# Altium project BMS_Master.PrjPcb (part 1 of 2)
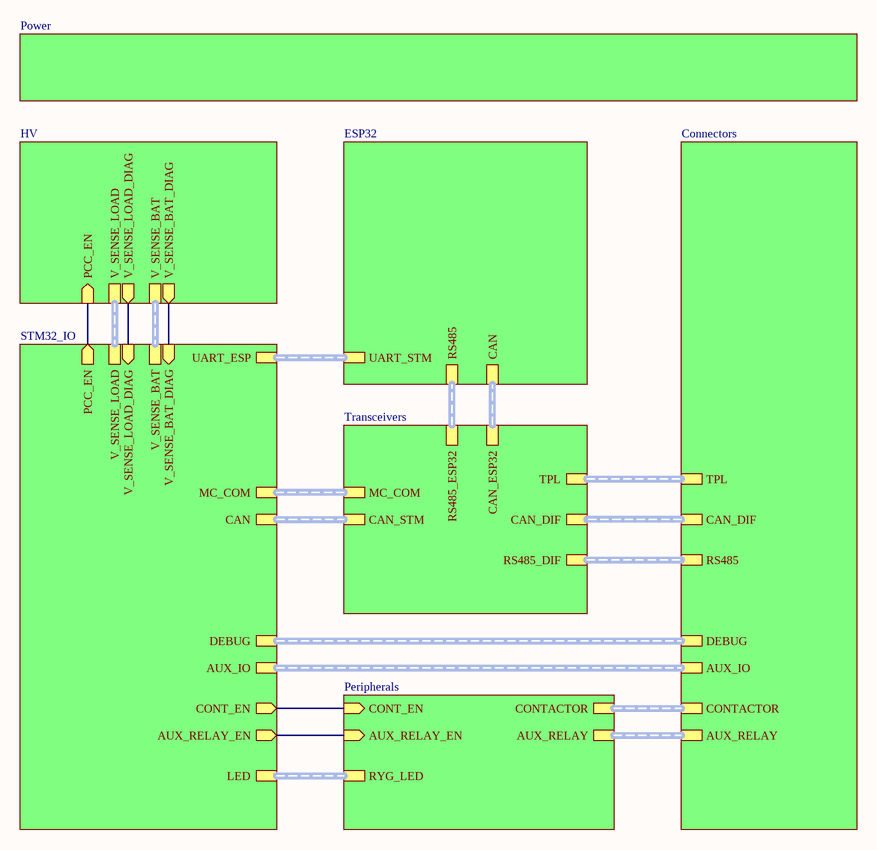
[diagram p0: Top.SchDoc]
Author: Bram Bremer; ProjectPrettyName: BMS Master
10 sheets, 231 parts. Net scope: hierarchical (ports join the sheet entries above them; power ports are global).
Board file: Master.PcbDoc
Sheets:
  Top.SchDoc
    STM32 = STM32_IO.SchDoc
    Power = Power.SchDoc
    Transceivers = Transceivers.SchDoc
    Peripherals = Peripherals.SchDoc
      ContactorDriver = RelayDriver.SchDoc
      AuxRelay = RelayDriver.SchDoc
    Connectors = Connectors.SchDoc
    Designator = HV.SchDoc
      LOADsense = HVsense.SchDoc
      BATsense = HVsense.SchDoc
    ESP32 = ESP32.SchDoc

## Sheet Top.SchDoc: Top level
size A4; Author: Bram Bremer; CompanyName: Green Team Twente; Organization: Green Team Twente; Revision: V1.1; SheetNumber: 1; SheetTotal: 10; Team: 2024; Subsystem: Embedded Systems

### Sub-sheets
Connectors = Connectors: CAN_DIF (harness CAN_DIF), TPL (harness TPL), CONTACTOR (harness CONTACTOR), DEBUG (harness STDC14), RS485 (harness RS485_DIF), AUX_RELAY (harness AUX_RELAY), AUX_IO (harness AUX_IO)
Designator = HV: PCC_EN (in), V_SENSE_LOAD, V_SENSE_BAT, V_SENSE_LOAD_DIAG (out), V_SENSE_BAT_DIAG (out)
ESP32 = ESP32: RS485 (harness RS485), CAN (harness CAN), UART_STM (harness UART)
Peripherals = Peripherals: CONT_EN (in), RYG_LED (harness RGB_LED), CONTACTOR (harness CONTACTOR), AUX_RELAY_EN (in), AUX_RELAY (harness AUX_RELAY)
Power = Power: no entries
STM32 = STM32_IO: DEBUG (harness STDC14), MC_COM (harness MC_COM), CAN (harness CAN), LED (harness RYG_LED), AUX_RELAY_EN (out), CONT_EN (out), V_SENSE_LOAD (harness ANA_DIF), V_SENSE_BAT (harness ANA_DIF), PCC_EN (out), V_SENSE_LOAD_DIAG (in), V_SENSE_BAT_DIAG (in), AUX_IO (harness AUX_IO), UART_ESP (harness UART)
Transceivers = Transceivers: CAN_STM (harness CAN), MC_COM (harness MC_COM), CAN_DIF (harness CAN_DIF), TPL (harness TPL), CAN_ESP32 (harness CAN), RS485_DIF (harness RS485_DIF), RS485_ESP32 (harness RS485)

### Nets
AUX_RELAY_EN: sheet STM32/AUX_RELAY_EN, sheet Peripherals/AUX_RELAY_EN
CONT_EN: sheet STM32/CONT_EN, sheet Peripherals/CONT_EN
PCC_EN: sheet STM32/PCC_EN, sheet Designator/PCC_EN
V_SENSE_BAT_DIAG: sheet STM32/V_SENSE_BAT_DIAG, sheet Designator/V_SENSE_BAT_DIAG
V_SENSE_LOAD_DIAG: sheet STM32/V_SENSE_LOAD_DIAG, sheet Designator/V_SENSE_LOAD_DIAG

### Buses and harness runs
harness sheet Connectors/AUX_IO = sheet STM32/AUX_IO
harness sheet Connectors/AUX_RELAY = sheet Peripherals/AUX_RELAY
harness sheet Connectors/CAN_DIF = sheet Transceivers/CAN_DIF
harness sheet Connectors/CONTACTOR = sheet Peripherals/CONTACTOR
harness sheet Connectors/DEBUG = sheet STM32/DEBUG
harness sheet Connectors/RS485 = sheet Transceivers/RS485_DIF
harness sheet Connectors/TPL = sheet Transceivers/TPL
harness sheet Designator/V_SENSE_BAT = sheet STM32/V_SENSE_BAT
harness sheet Designator/V_SENSE_LOAD = sheet STM32/V_SENSE_LOAD
harness sheet ESP32/CAN = sheet Transceivers/CAN_ESP32
harness sheet ESP32/RS485 = sheet Transceivers/RS485_ESP32
harness sheet ESP32/UART_STM = sheet STM32/UART_ESP
harness sheet Peripherals/RYG_LED = sheet STM32/LED
harness sheet STM32/CAN = sheet Transceivers/CAN_STM
harness sheet STM32/MC_COM = sheet Transceivers/MC_COM

### Notes on the sheet
- Team
- Authors
- Revision
- Title
- Project
- Subsystem
- File
- Sheet
- //

## Sheet STM32_IO.SchDoc: STM32 IO
size A3; CompanyName: Green Team Twente; Organization: Green Team Twente; Revision: V1.1; SheetNumber: 4; SheetTotal: 10; Team: 2024; Subsystem: Embedded Systems
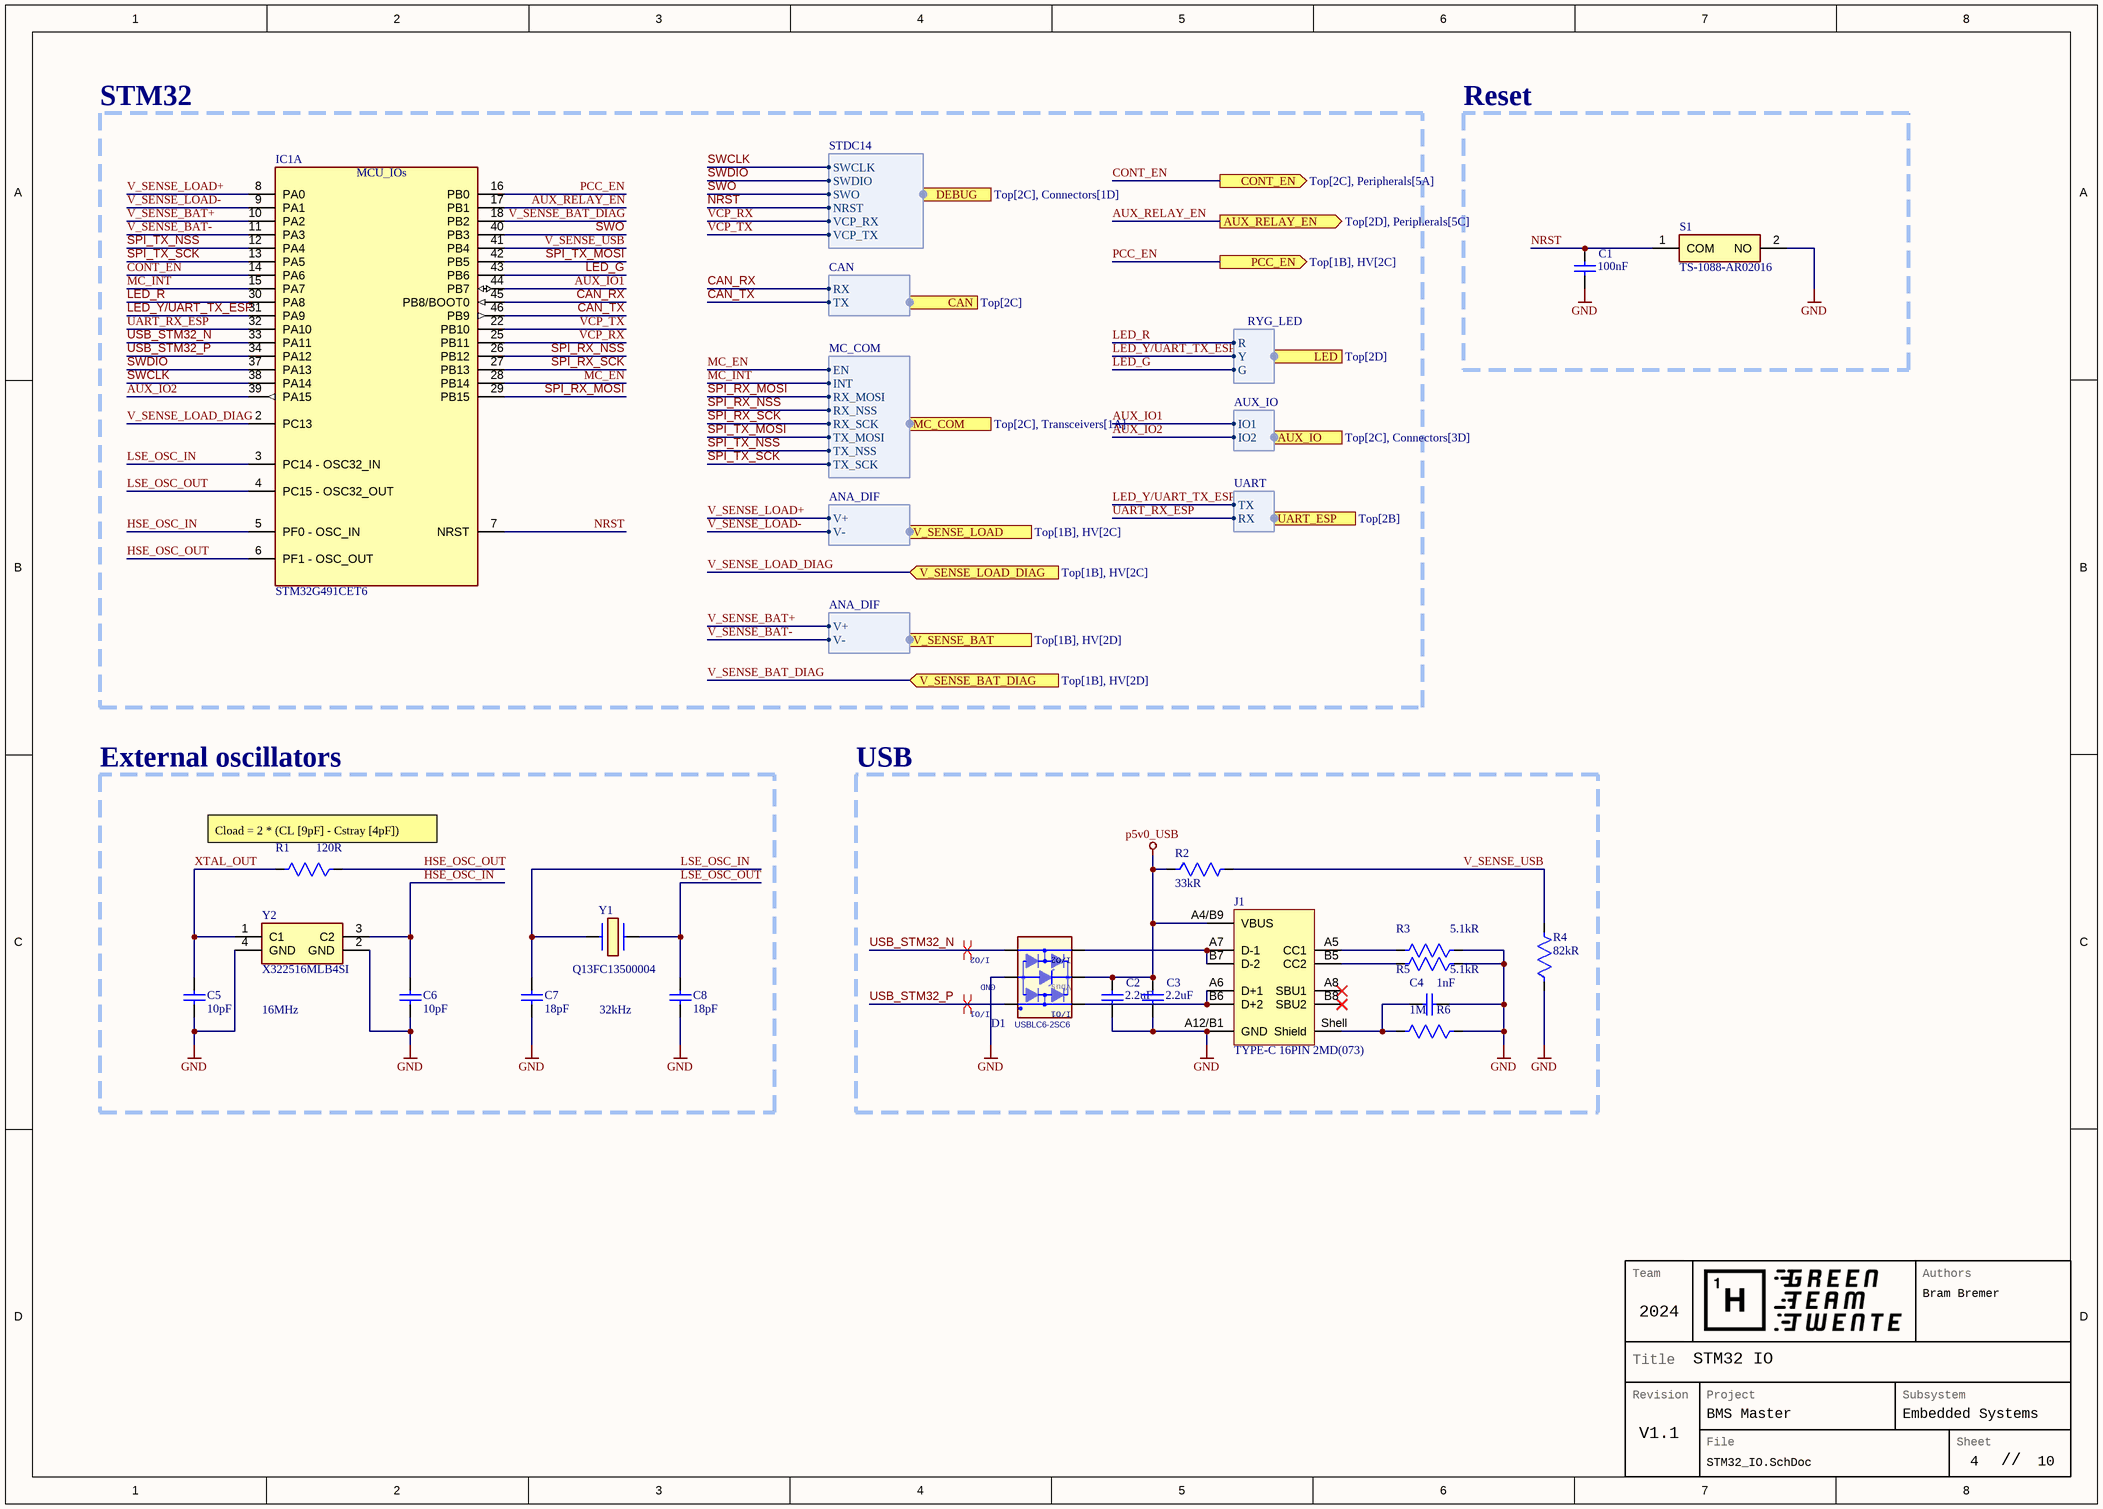
[diagram p1: STM32_IO.SchDoc]

### Parts
C1  value 100nF  [WCAP-CSGP_0402_L1W0.5H0.5]  (hidden comment: CAP 0402 100nF X7R)
C2  value 2.2uF  [WCAP-CSGP_0603_L1.6W0.8H0.8_Reflow]  (hidden comment: CAP 0603 2.2uF X7R)
C3  value 2.2uF  [WCAP-CSGP_0603_L1.6W0.8H0.8_Reflow]  (hidden comment: CAP 0603 2.2uF X7R)
C4  value 1nF  [WCAP-CSGP_1206_L3.2W1.6H1.15]  (hidden comment: CAP 1206 1nF X7R)
C5  value 10pF  [WCAP-CSGP_0402_L1W0.5H0.5]  (hidden comment: CAP 0402 10pF X7R)
C6  value 10pF  [WCAP-CSGP_0402_L1W0.5H0.5]  (hidden comment: CAP 0402 10pF X7R)
C7  value 18pF  [WCAP-CSGP_0402_L1W0.5H0.5]  (hidden comment: CAP 0402 18pF X7R)
C8  value 18pF  [WCAP-CSGP_0402_L1W0.5H0.5]  (hidden comment: CAP 0402 18pF X7R)
D1  USBLC6-2SC6  [ST_SOT23-6L]
IC1  STM32G491CET6  [QFP50P900X900X160-48N]  (part A of 2)
J1  TYPE-C 16PIN 2MD(073)  [629722000214]
R1  value 120R  [FP0402]  (hidden comment: RES 0402 120R 1%)
R2  value 33kR  [FP0402]  (hidden comment: RES 0402 33kR 1%)
R3  value 5.1kR  [FP0402]  (hidden comment: RES 0402 5.1kR 1%)
R4  value 82kR  [RES_SM0603_YAGEORC_N]  (hidden comment: RES 0603 82kR 1%)
R5  value 5.1kR  [FP0402]  (hidden comment: RES 0402 5.1kR 1%)
R6  value 1M  [RES_SM1206_YAGEORC_N]  (hidden comment: RES 1206 1M 1%)
S1  TS-1088-AR02016  [TS1088AR02016]
Y1  Q13FC13500004  [Q13FC1350000400]
Y2  X322516MLB4SI  [X322516MLB4SI]

### Blocks framed on the sheet
STM32: IC1
Reset: C1 S1
External oscillators: C5-C8 R1 Y1 Y2
USB: C2-C4 D1 J1 R2-R6

### Ports
AUX_IO (out, harness AUX_IO, see Top[2C], Connectors[3D]), AUX_RELAY_EN (out, see Top[2D], Peripherals[5C]), CAN (harness CAN, see Top[2C]), CONT_EN (out, see Top[2C], Peripherals[5A]), DEBUG (harness STDC14, see Top[2C], Connectors[1D]), LED (harness RYG_LED, see Top[2D]), MC_COM (out, harness MC_COM, see Top[2C], Transceivers[1A]), PCC_EN (out, see Top[1B], HV[2C]), UART_ESP (out, harness UART, see Top[2B]), V_SENSE_BAT (out, harness ANA_DIF, see Top[1B], HV[2D]), V_SENSE_BAT_DIAG (in, see Top[1B], HV[2D]), V_SENSE_LOAD (out, harness ANA_DIF, see Top[1B], HV[2C]), V_SENSE_LOAD_DIAG (in, see Top[1B], HV[2C])

### Harnesses
MC_COM: EN, INT, RX_MOSI, RX_NSS, RX_SCK, TX_MOSI, TX_NSS, TX_SCK
CAN: RX, TX
RYG_LED: G, R, Y
ANA_DIF: V+, V-
AUX_IO: IO1, IO2
STDC14: SWDIO, SWCLK, NRST, SWO, VCP_RX, VCP_TX
UART: TX, RX

### Nets
GND: C1.1 C2.1 C3.1 C4.2 C5.1 C6.1 C7.1 C8.1 D1.2(GND) J1.A12/B1(GND) R3.1 R4.1 R5.1 R6.1 S1.2(NO) Y2.2(GND) Y2.4(GND)
p5v0_USB: C2.2 C3.2 D1.5(Vbus) J1.A4/B9(VBUS) R2.1
AUX_IO1: IC1.44(PB7) ; port AUX_IO.IO1
AUX_IO2: IC1.39(PA15) ; port AUX_IO.IO2
AUX_RELAY_EN: IC1.17(PB1) ; port AUX_RELAY_EN
CAN_RX: IC1.45(PB8/BOOT0) ; port CAN.RX
CAN_TX: IC1.46(PB9) ; port CAN.TX  [project net CAN_STM_TX]
CONT_EN: IC1.14(PA6) ; port CONT_EN
HSE_OSC_IN: C6.2 IC1.5(PF0_-_OSC_IN) Y2.3(C2)
HSE_OSC_OUT: IC1.6(PF1_-_OSC_OUT) R1.1
LED_G: IC1.43(PB6) ; port LED.G
LED_R: IC1.30(PA8) ; port LED.R
LED_Y/UART_TX_ESP: IC1.31(PA9) ; port LED.Y, port UART_ESP.TX  [project net LED_Y]
LSE_OSC_IN: C7.2 IC1.3(PC14_-_OSC32_IN) Y1.2(CRYSTAL_2)
LSE_OSC_OUT: C8.2 IC1.4(PC15_-_OSC32_OUT) Y1.1(CRYSTAL_1)
MC_EN: IC1.28(PB14) ; port MC_COM.EN
MC_INT: IC1.15(PA7) ; port MC_COM.INT
NRST: C1.2 IC1.7(NRST) S1.1(COM) ; port DEBUG.NRST
PCC_EN: IC1.16(PB0) ; port PCC_EN
SPI_RX_MOSI: IC1.29(PB15) ; port MC_COM.RX_MOSI  [project net MC_RX_MOSI]
SPI_RX_NSS: IC1.26(PB12) ; port MC_COM.RX_NSS  [project net MC_RX_NSS]
SPI_RX_SCK: IC1.27(PB13) ; port MC_COM.RX_SCK  [project net MC_RX_SCK]
SPI_TX_MOSI: IC1.42(PB5) ; port MC_COM.TX_MOSI  [project net MC_TX_MOSI]
SPI_TX_NSS: IC1.12(PA4) ; port MC_COM.TX_NSS  [project net MC_TX_NSS]
SPI_TX_SCK: IC1.13(PA5) ; port MC_COM.TX_SCK  [project net MC_TX_SCK]
SWCLK: IC1.38(PA14) ; port DEBUG.SWCLK
SWDIO: IC1.37(PA13) ; port DEBUG.SWDIO
SWO: IC1.40(PB3) ; port DEBUG.SWO
UART_RX_ESP: IC1.32(PA10) ; port UART_ESP.RX
USB_STM32_N: D1.3(I/O2) IC1.33(PA11)
USB_STM32_P: D1.1(I/O1) IC1.34(PA12)
V_SENSE_BAT+: IC1.10(PA2) ; port V_SENSE_BAT.V+  [project net V_P]
V_SENSE_BAT-: IC1.11(PA3) ; port V_SENSE_BAT.V-  [project net V_N]
V_SENSE_BAT_DIAG: IC1.18(PB2) ; port V_SENSE_BAT_DIAG
V_SENSE_LOAD+: IC1.8(PA0) ; port V_SENSE_LOAD.V+  [project net V_P]
V_SENSE_LOAD-: IC1.9(PA1) ; port V_SENSE_LOAD.V-  [project net V_N]
V_SENSE_LOAD_DIAG: IC1.2(PC13) ; port V_SENSE_LOAD_DIAG
V_SENSE_USB: IC1.41(PB4) R2.2 R4.2
VCP_RX: IC1.25(PB11) ; port DEBUG.VCP_RX
VCP_TX: IC1.22(PB10) ; port DEBUG.VCP_TX
XTAL_OUT: C5.2 R1.2 Y2.1(C1)
NetC4_1: C4.1 J1.Shell(Shield) R6.2
NetD1_4: D1.4(I/O2+) J1.A7(D-1) J1.B7(D-2)
NetD1_6: D1.6(I/O1+) J1.A6(D+1) J1.B6(D+2)
NetJ1_A5: J1.A5(CC1) R3.2
NetJ1_B5: J1.B5(CC2) R5.2

Not connected (* = marked no-connect by the designer): J1 A8(SBU1)* B8(SBU2)*

### Layout directives
differential pair; differential pair class USB90; rule Clearance Constraint [Generic clearance = 0.15mm, and 12 value(s) for objects]: USB_STM32_N, USB_STM32_P

### Notes on the sheet
- (near R1) Cload = 2 * (CL [9pF] - Cstray [4pF])
- 16MHz
- 32kHz
- Team
- Authors
- Revision
- Title
- Project
- Subsystem
- File
- Sheet
- //
- (in symbol CMP-031-00032-4, part A) MCU_IOs

### Library data of the parts
C1 C5-C8 = CMP-001-01308-5: GTT Standard 0402 non-polarized capacitor; Pins: 2; Case/Package: 0402; Category: Multilayer Ceramic Chip Capacitors; Ceramic Type: X7R
  C1: JLCPCB Part #: C1525
  C5 C6: JLCPCB Part #: C32949
  C7 C8: JLCPCB Part #: C1549
C2 C3 = CMP-001-01309-1: GTT Standard 0603 non-polarized capacitor; Case/Package: 0603; Category: Multilayer Ceramic Chip Capacitors; Ceramic Type: X7R; Pins: 2; JLCPCB Part #: C23630
C4 = CMP-001-01311-1: GTT Standard 1206 non-polarized capacitor; Voltage Rating: 2kV; Case/Package: 1206; Ceramic Type: X7R; Category: Multilayer Ceramic Chip Capacitors; Pins: 2; JLCPCB Part #: C9196
D1 = CMP-004-00059-1: Design Item ID: USBLC6-2SC6; Source: USBLC6-2SC6.SchLib
IC1 = CMP-031-00032-4: ARM Microcontrollers - MCU Mainstream Arm Cortex-M4+ MCU 170MHz with 512Kbytes of Flash memory; Manufacturer_Name: STMicroelectronics; Arrow Part Number: STM32G491CET6; Source: TempSchematics.schlib; Mouser Part Number: 511-STM32G491CET6; Datasheet Link: https://cz.mouser.com/datasheet/2/389/dm00654712-2042072.pdf; Manufacturer_Part_Number: STM32G491CET6; Design Item ID: STM32G491CET6; Mouser Price/Stock: https://www.mouser.co.uk/ProductDetail/STMicroelectronics/STM32G491CET6?qs=eP2BKZSCXI5LxAF%2FNuF5Tg%3D%3D; Arrow Price/Stock: https://www.arrow.com/en/products/stm32g491cet6/stmicroelectronics?region=nac; Height: 1.6mm
J1 = CMP-002-000088-9: WR-USB 2.0 Type C, Receptacle, Horizontal, SMT; pin to pad: A4/B9>A4/B9+A9/B4 A12/B1>A12/B1+A1/B12; Manufacturer: Wurth Elektronik; Number of Ports: 1; Interface Type: Type C; Working Voltage: 20VAC; Rated Current: 5A; ComponentLink1URL: https://www.we-online.com/redexpert/article/629722000214?ad; Number of Pins: 16; ComponentLink2Description: Datasheet Link; Component Type: Standard; Mount: Surface Mount; Manufacturer Part Number: 629722000214; Orientation: Horizontal; Design Item ID: 629722000214; Operating Temperature Max: 85°C; Packaging: Tape and Reel; Operating Temperature Min: -40°C; ComponentLink2URL: https://www.we-online.com/redexpert/spec/629722000214?ad; Pin Count: 13; Source: WR-USB.SchLib; Gender: Receptacle; Application: USB 2.0; Match Code: WR-USB; ComponentLink1Description: Website Link; Category: Input/Output Connectors
R1-R3 R5 = CMP-009-00204-17: GTT Standard 0402 Resistor; Voltage Rating: 50V; Power: 62.5mW; Mounting Technology: SMD; Tolerance: 1%; Case/Package: 0402; Design Item ID: RES 0402; Source: Passives.SchLib
  R1: JLCPCB Part #: C25079
  R2: JLCPCB Part #: C25779
  R3 R5: JLCPCB Part #: C25905
R4 = CMP-009-00206-3: GTT Standard 0603 Resistor; Voltage Rating: 50V; Power: 62.5mW; Case/Package: 0603; Tolerance: 1%; Mounting Technology: SMD; JLCPCB Part #: C23254
R6 = CMP-009-00208-3: GTT Standard 1206 Resistor; Voltage Rating: 50V; Power: 62.5mW; Tolerance: 1%; Case/Package: 1206; Mounting Technology: SMD; JLCPCB Part #: C17927
S1 = TS-1088-AR02016: Switch; Manufacturer_Name: XUNPU; Datasheet Link: https://www.xunpudianzi.com/uploads/pdf/TS-1088-ARXXX.pdf; Height: 2mm; Manufacturer_Part_Number: TS-1088-AR02016
Y1 = Q13FC13500004: Crystal or Oscillator; Manufacturer_Name: Seiko Epson Corporation; Datasheet Link: https://datasheet.lcsc.com/szlcsc/1901081604_Seiko-Epson-Q13FC1350000400_C32346.pdf; Height: 0.9mm; Manufacturer_Part_Number: Q13FC1350000400
Y2 = X322516MLB4SI: Crystal or Oscillator; Manufacturer_Name: Yangxing Tech; Datasheet Link: https://datasheet.lcsc.com/szlcsc/Yangxing-Tech-X322516MLB4SI_C13738.pdf; Height: 0.8mm; Manufacturer_Part_Number: X322516MLB4SI

## Sheet Power.SchDoc: Power
size A3; CompanyName: Green Team Twente; Organization: Green Team Twente; Revision: V1.1; SheetNumber: 5; SheetTotal: 10; Team: 2024; Subsystem: Embedded Systems; SPICEModelCacheQRFOQSXK: <root> / <DocumentId>QRFOQSXK</DocumentId> / </root>
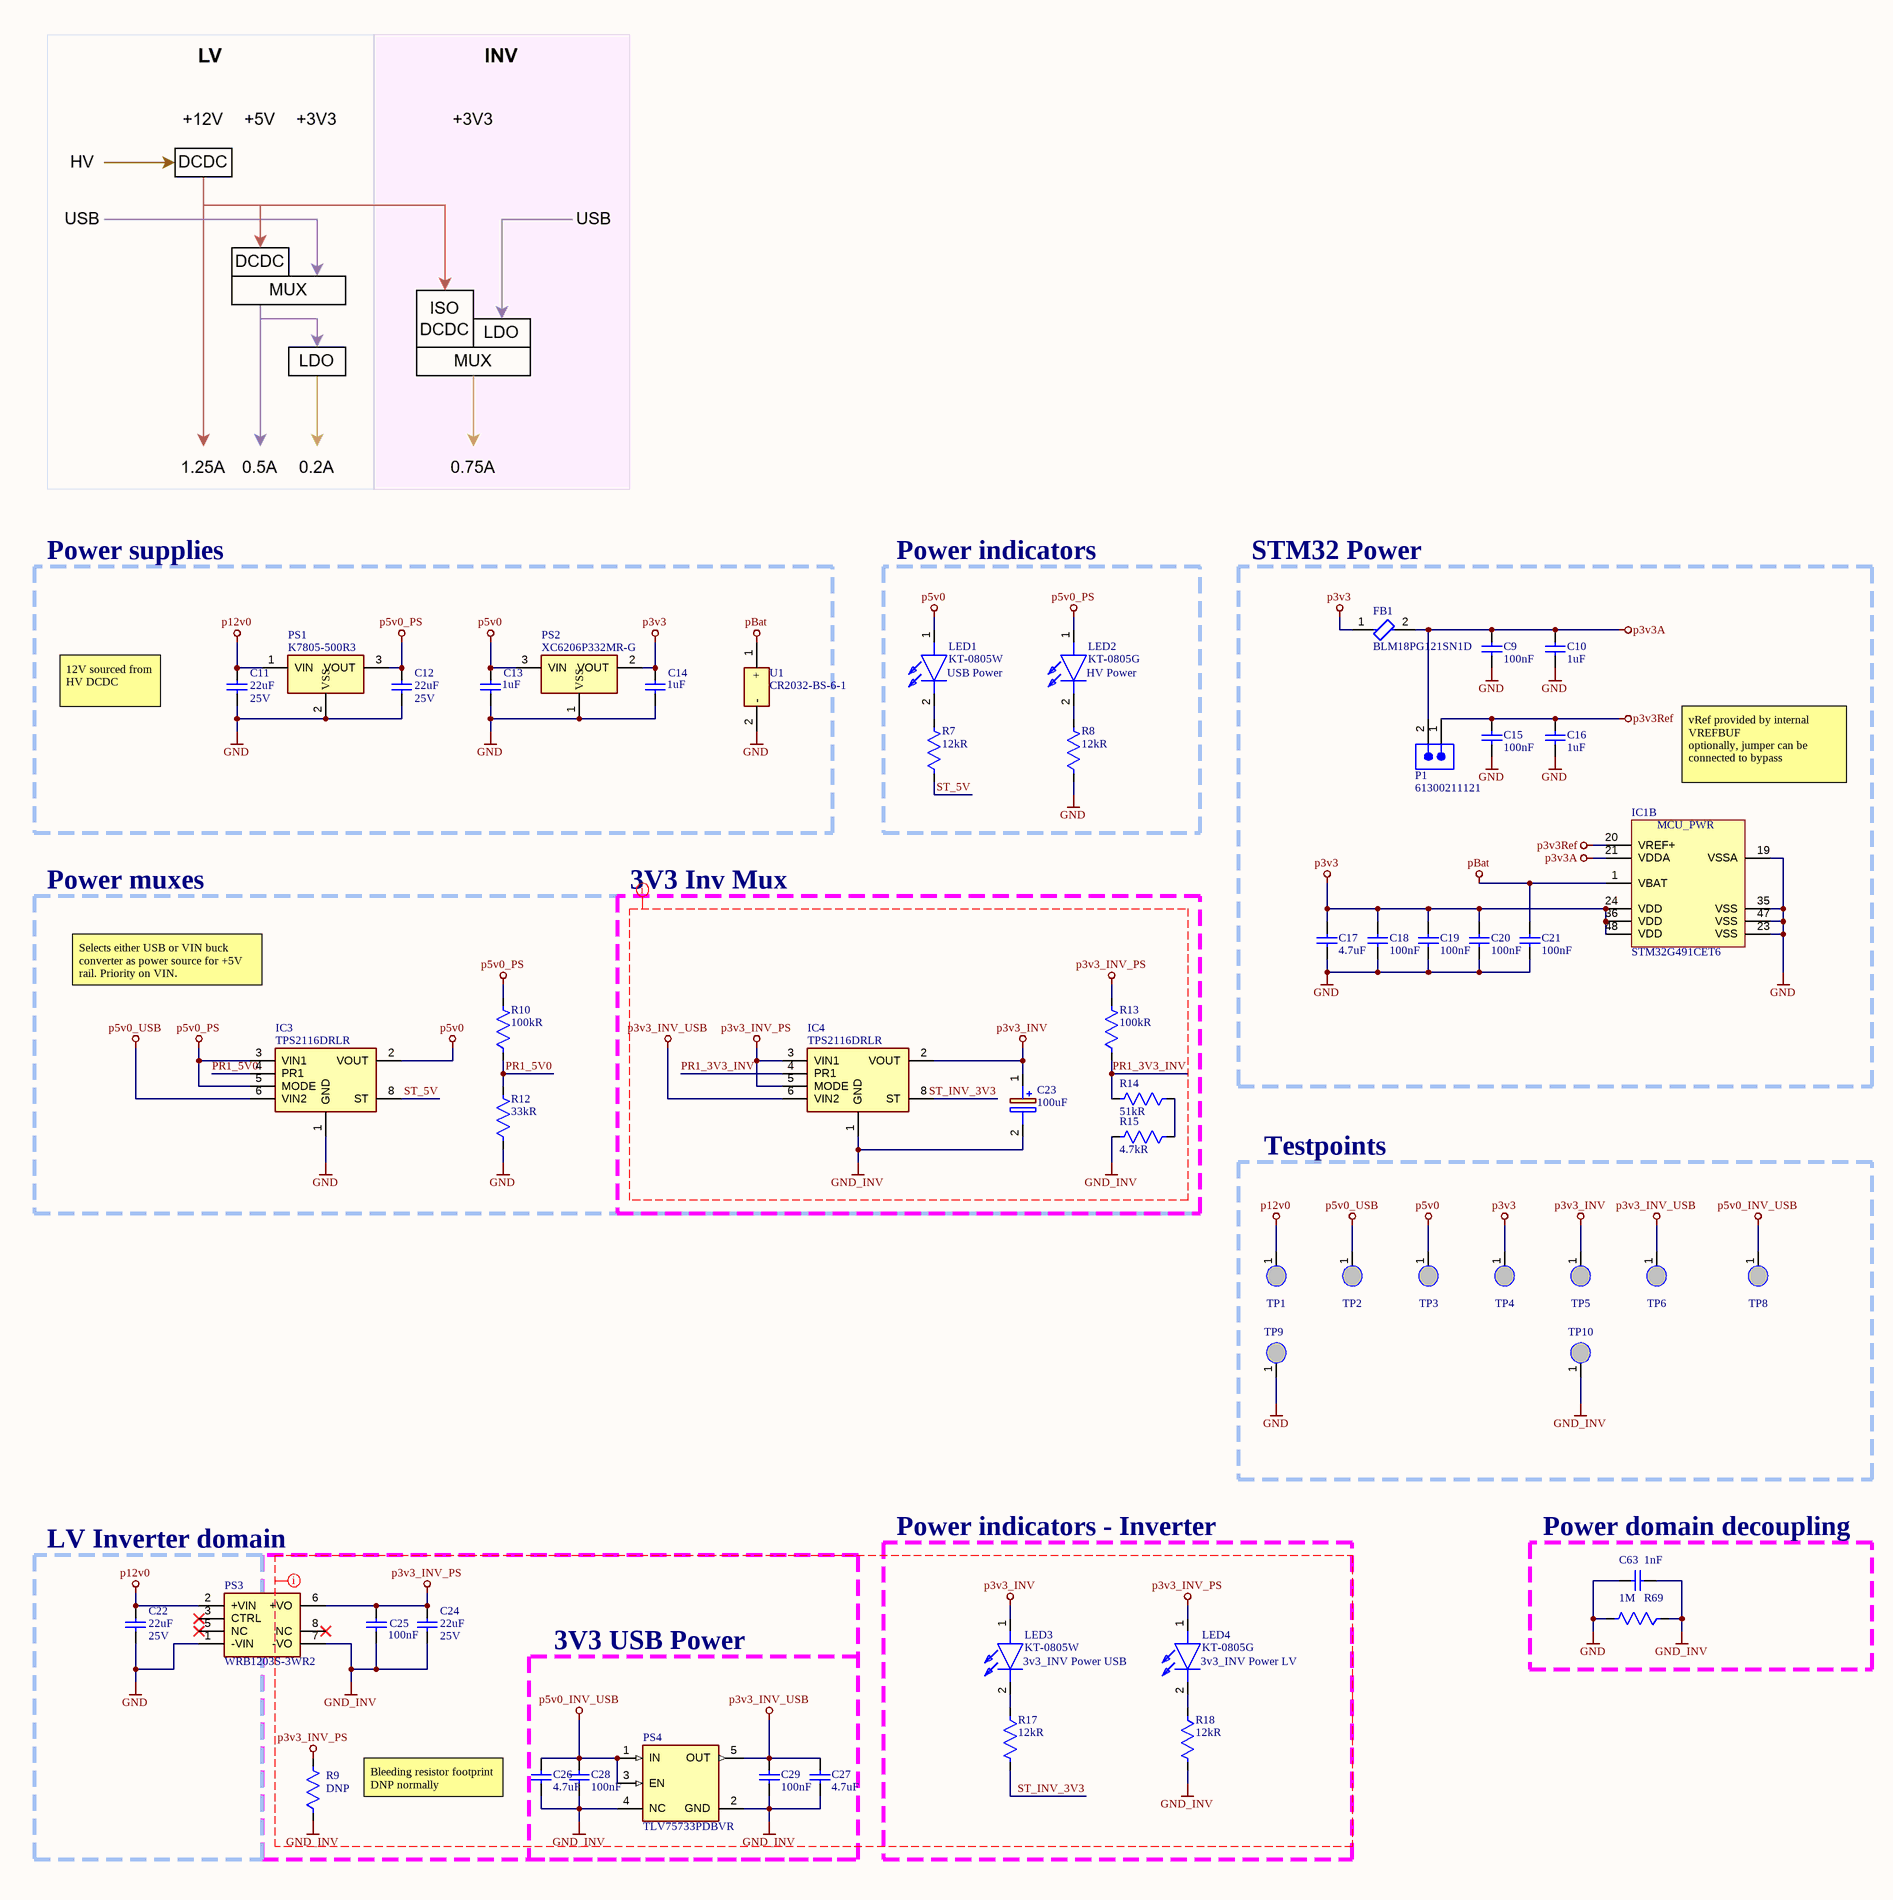
[diagram p2: Power.SchDoc, left]
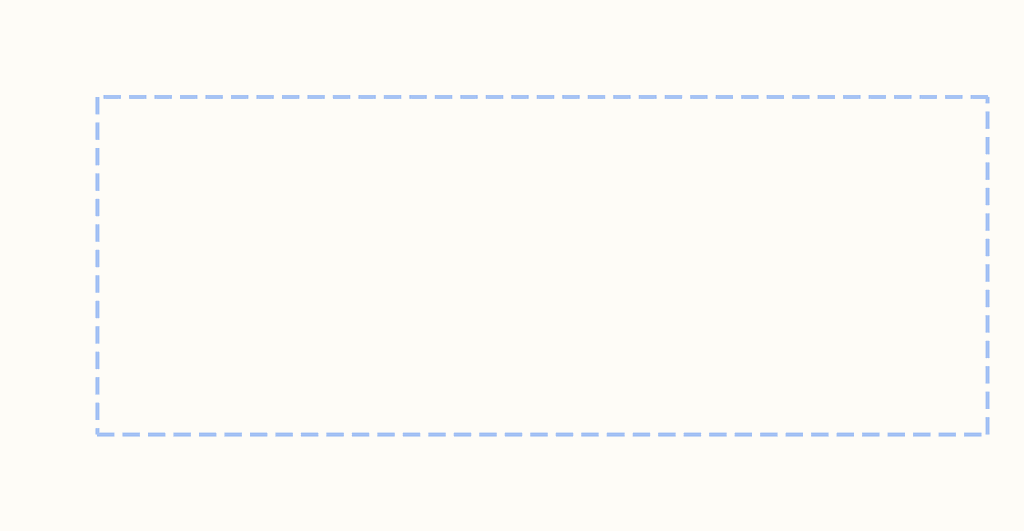
[diagram p3: Power.SchDoc, right]

### Parts
C9  value 100nF  [WCAP-CSGP_0402_L1W0.5H0.5]  (hidden comment: CAP 0402 100nF X7R)
C10  value 1uF  [WCAP-CSGP_0603_L1.6W0.8H0.8_Reflow]  (hidden comment: CAP 0603 1uF X7R)
C11  value 22uF  Voltage Rating: 25V  [WCAP-CSGP_1206_L3.2W1.6H1.15]  (hidden comment: CAP 1206 22uF X7R)
C12  value 22uF  Voltage Rating: 25V  [WCAP-CSGP_1206_L3.2W1.6H1.15]  (hidden comment: CAP 1206 22uF X7R)
C13  value 1uF  [WCAP-CSGP_0603_L1.6W0.8H0.8_Reflow]  (hidden comment: CAP 0603 1uF X7R)
C14  value 1uF  [WCAP-CSGP_0603_L1.6W0.8H0.8_Reflow]  (hidden comment: CAP 0603 1uF X7R)
C15  value 100nF  [WCAP-CSGP_0402_L1W0.5H0.5]  (hidden comment: CAP 0402 100nF X7R)
C16  value 1uF  [WCAP-CSGP_0603_L1.6W0.8H0.8_Reflow]  (hidden comment: CAP 0603 1uF X7R)
C17  value 4.7uF  [WCAP-CSGP_0603_L1.6W0.8H0.8_Reflow]  (hidden comment: CAP 0603 4.7uF X7R)
C18  value 100nF  [WCAP-CSGP_0402_L1W0.5H0.5]  (hidden comment: CAP 0402 100nF X7R)
C19  value 100nF  [WCAP-CSGP_0402_L1W0.5H0.5]  (hidden comment: CAP 0402 100nF X7R)
C20  value 100nF  [WCAP-CSGP_0402_L1W0.5H0.5]  (hidden comment: CAP 0402 100nF X7R)
C21  value 100nF  [WCAP-CSGP_0402_L1W0.5H0.5]  (hidden comment: CAP 0402 100nF X7R)
C22  value 22uF  Voltage Rating: 25V  [WCAP-CSGP_1206_L3.2W1.6H1.15]  (hidden comment: CAP 1206 22uF X7R)
C23  value 100uF  [CAPAE660X800N]  (hidden comment: VEJ101M1ETR-0607)
C24  value 22uF  Voltage Rating: 25V  [WCAP-CSGP_1206_L3.2W1.6H1.15]  (hidden comment: CAP 1206 22uF X7R)
C25  value 100nF  [WCAP-CSGP_0402_L1W0.5H0.5]  (hidden comment: CAP 0402 100nF X7R)
C26  value 4.7uF  [WCAP-CSGP_0603_L1.6W0.8H0.8_Reflow]  (hidden comment: CAP 0603 4.7uF X5R)
C27  value 4.7uF  [WCAP-CSGP_0603_L1.6W0.8H0.8_Reflow]  (hidden comment: CAP 0603 4.7uF X5R)
C28  value 100nF  [WCAP-CSGP_0402_L1W0.5H0.5]  (hidden comment: CAP 0402 100nF X7R)
C29  value 100nF  [WCAP-CSGP_0402_L1W0.5H0.5]  (hidden comment: CAP 0402 100nF X7R)
C63  value 1nF  [WCAP-CSGP_1206_L3.2W1.6H1.15]  (hidden comment: CAP 1206 1nF X7R)
FB1  BLM18PG121SN1D  [FP-BLM18-0_15-t0_8-IPC_A]
IC1  STM32G491CET6  [QFP50P900X900X160-48N]  (part B of 2)
IC3  TPS2116DRLR  [SOTFL50P160X60-8N]
IC4  TPS2116DRLR  [SOTFL50P160X60-8N]
LED1  KT-0805W  [KT0805G]
LED2  KT-0805G  [KT0805G]
LED3  KT-0805W  [KT0805G]
LED4  KT-0805G  [KT0805G]
P1  61300211121  [61300211121]
PS1  K7805-500R3  [K7805500R3]
PS2  XC6206P332MR-G  [SOT95P280X130-3N]
PS3  WRB1203S-3WR2  [WRB1203S3WR2]
PS4  TLV75733PDBVR  [FP-DBV0005A-MFG]
R7  value 12kR  [FP0402]  (hidden comment: RES 0402 12kR 1%)
R8  value 12kR  [FP0402]  (hidden comment: RES 0402 12kR 1%)
R9  value DNP  [RES_SM1206_YAGEORC_N]  (hidden comment: RES 1206 DNP 1%)
R10  value 100kR  [FP0402]  (hidden comment: RES 0402 100kR 1%)
R12  value 33kR  [FP0402]  (hidden comment: RES 0402 33kR 1%)
R13  value 100kR  [FP0402]  (hidden comment: RES 0402 100kR 1%)
R14  value 51kR  [FP0402]  (hidden comment: RES 0402 51kR 1%)
R15  value 4.7kR  [FP0402]  (hidden comment: RES 0402 4.7kR 1%)
R17  value 12kR  [RES_SM0603_YAGEORC_N]  (hidden comment: RES 0603 12kR 1%)
R18  value 12kR  [RES_SM0603_YAGEORC_N]  (hidden comment: RES 0603 12kR 1%)
R69  value 1M  [RES_SM1206_YAGEORC_N]  (hidden comment: RES 1206 1M 1%)
TP1  GTT_ProbeerPunt  [GTT_ProbeerPuntFP]  (value not drawn)  (no BOM)
TP2  GTT_ProbeerPunt  [GTT_ProbeerPuntFP]  (value not drawn)  (no BOM)
TP3  GTT_ProbeerPunt  [GTT_ProbeerPuntFP]  (value not drawn)  (no BOM)
TP4  GTT_ProbeerPunt  [GTT_ProbeerPuntFP]  (value not drawn)  (no BOM)
TP5  GTT_ProbeerPunt  [GTT_ProbeerPuntFP]  (value not drawn)  (no BOM)
TP6  GTT_ProbeerPunt  [GTT_ProbeerPuntFP]  (value not drawn)  (no BOM)
TP8  GTT_ProbeerPunt  [GTT_ProbeerPuntFP]  (value not drawn)  (no BOM)
TP9  GTT_ProbeerPunt  [GTT_ProbeerPuntFP]  (value not drawn)  (no BOM)
TP10  GTT_ProbeerPunt  [GTT_ProbeerPuntFP]  (value not drawn)  (no BOM)
U1  CR2032-BS-6-1  [CR2032BS61]

### Blocks framed on the sheet
Power supplies: C11-C14 PS1 PS2 U1
Power indicators: LED1 LED2 R7 R8
STM32 Power: C9 C10 C15-C21 FB1 IC1 P1
Power muxes: IC3 R10 R12
3V3 Inv Mux: C23 IC4 R13-R15
Testpoints: TP1-TP6 TP8-TP10
LV Inverter domain: C22 PS3
Power indicators - Inverter: LED3 LED4 R17 R18
Power domain decoupling: C63 R69
3V3 USB Power: C26-C29 PS4

### Nets
GND: C9.1 C10.2 C11.1 C12.1 C13.1 C14.1 C15.1 C16.2 C17.2 C18.1 C19.1 C20.1 C21.1 C22.1 C63.1 IC1.19(VSSA) IC1.23(VSS) IC1.35(VSS) IC1.47(VSS) IC3.1(GND) PS1.2(VSS) PS2.1(VSS) PS3.1(-VIN) R8.1 R12.1 R69.2 TP9.1 U1.2(-)
GND_INV: C23.2(-) C24.1 C25.1 C26.2 C27.2 C28.1 C29.1 C63.2 IC4.1(GND) PS3.7(-VO) PS4.2(GND) PS4.4(NC) R9.1 R15.2 R18.2 R69.1 TP10.1
p3v3: C14.2 C17.1 C18.2 C19.2 C20.2 FB1.1 IC1.24(VDD) IC1.36(VDD) IC1.48(VDD) PS2.2(VOUT) TP4.1
p3v3_INV: C23.1(+) IC4.2(VOUT) LED3.1(A) TP5.1
p3v3_INV_PS: C24.2 C25.2 IC4.3(VIN1) IC4.5(MODE) LED4.1(A) PS3.6(+VO) R9.2 R13.2
p3v3_INV_USB: C27.1 C29.2 IC4.6(VIN2) PS4.5(OUT) TP6.1
p3v3A: C9.2 C10.1 FB1.2 IC1.21(VDDA) P1.2
p3v3Ref: C15.2 C16.1 IC1.20(VREF+) P1.1
p5v0: C13.2 IC3.2(VOUT) LED1.1(A) PS2.3(VIN) TP3.1
p5v0_INV_USB: C26.1 C28.2 PS4.1(IN) PS4.3(EN) TP8.1
p5v0_PS: C12.2 IC3.3(VIN1) IC3.5(MODE) LED2.1(A) PS1.3(VOUT) R10.2
p5v0_USB: IC3.6(VIN2) TP2.1
p12v0: C11.2 C22.2 PS1.1(VIN) PS3.2(+VIN) TP1.1
pBat: C21.2 IC1.1(VBAT) U1.1(+)
PR1_3V3_INV: IC4.4(PR1) R13.1 R14.2
PR1_5V0: IC3.4(PR1) R10.1 R12.2
ST_5V: IC3.8(ST) R7.1
ST_INV_3V3: IC4.8(ST) R17.2
NetLED1_2: LED1.2(K) R7.2
NetLED2_2: LED2.2(K) R8.2
NetLED3_2: LED3.2(K) R17.1
NetLED4_2: LED4.2(K) R18.1
NetR14_1: R14.1 R15.1

Not connected (* = marked no-connect by the designer): PS3 3(CTRL)* 5(NC)* 8(NC)*

### Layout directives
net class INV: GND_INV, p3v3_INV, p3v3_INV_PS, p3v3_INV_USB, p5v0_INV_USB, PR1_3V3_INV, ST_INV_3V3

### Notes on the sheet
- 12V sourced from HV DCDC
- (near LED1) USB Power
- (near LED2) HV Power
- vRef provided by internal VREFBUF
  optionally, jumper can be connected to bypass
- Selects either USB or VIN buck converter as power source for +5V rail. Priority on VIN.
- (near LED3) 3v3_INV Power USB
- (near LED4) 3v3_INV Power LV
- Bleeding resistor footprint
  DNP normally
- Team
- Authors
- Revision
- Title
- Project
- Subsystem
- File
- Sheet
- //
- (in symbol CMP-031-00032-4, part B) MCU_PWR

### Library data of the parts
C9 C15 C18-C21 C25 C28 C29 = CMP-001-01308-5: as C1 on sheet STM32_IO; Pins: 2; Case/Package: 0402; Category: Multilayer Ceramic Chip Capacitors; Ceramic Type: X7R; JLCPCB Part #: C1525
C10 C13 C14 C16 C17 C26 C27 = CMP-001-01309-1: as C2 on sheet STM32_IO; Case/Package: 0603; Category: Multilayer Ceramic Chip Capacitors; Pins: 2
  C10 C13 C14 C16: Ceramic Type: X7R; JLCPCB Part #: C15849
  C17: Ceramic Type: X7R; JLCPCB Part #: C19666
  C26 C27: Ceramic Type: X5R; JLCPCB Part #: C19666
C11 C12 C22 C24 = CMP-001-01311-1: GTT Standard 1206 non-polarized capacitor; Case/Package: 1206; Ceramic Type: X7R; Category: Multilayer Ceramic Chip Capacitors; Pins: 2; JLCPCB Part #: C12891
C23 = VEJ101M1ETR-0607: Capacitor Polarised; Manufacturer_Name: Lelon; Datasheet Link: https://www.mouser.de/datasheet/2/231/161587198639-2307150.pdf; Height: 8mm; Manufacturer_Part_Number: VEJ101M1ETR-0607; JLCPCB Part #: C176664
C63 = CMP-001-01311-1: as C4 on sheet STM32_IO; Case/Package: 1206; Ceramic Type: X7R; Category: Multilayer Ceramic Chip Capacitors; Pins: 2; JLCPCB Part #: C9196
FB1 = CMP-0686-00557-7: Chip Ferrite Bead, 0603, 120Ω @ 100MHz, 0.05Ω, 25%, 2A; Impedance: 120R; Number of Circuits: 1; Shielding: Unshielded; Material: Steel; DC Resistance (DCR): 50mR; Case Code (Imperial): 0603; RoHS Compliant: Yes; Number of Pins: 2; Min Operating Temperature: -55°C; Case Code (Metric): 1608; Frequency: 100MHz; Length: 1.6mm; Test Frequency: 100MHz; Max Operating Temperature: 125°C; Packaging: Tape and Reel; Max Current Rating: 2A; Termination: SMD/SMT; Lead Free: Lead Free; Max DC Current: 2A; Case/Package: 0603; Height: 0.8mm; Current Rating: 2A; Radiation Hardening: No; Core Material: Ferrite; DC Current: 2A; REACH SVHC: No SVHC; Package Quantity: 1; Depth: 0.8mm; Number of Lines: 1; Tolerance: 25%; Width: 0.8mm
IC1 = CMP-031-00032-4: as IC1 on sheet STM32_IO; Arrow Part Number: STM32G491CET6; Source: TempSchematics.schlib; Mouser Part Number: 511-STM32G491CET6; Datasheet Link: https://cz.mouser.com/datasheet/2/389/dm00654712-2042072.pdf; Manufacturer_Part_Number: STM32G491CET6; Design Item ID: STM32G491CET6; Mouser Price/Stock: https://www.mouser.co.uk/ProductDetail/STMicroelectronics/STM32G491CET6?qs=eP2BKZSCXI5LxAF%2FNuF5Tg%3D%3D; Arrow Price/Stock: https://www.arrow.com/en/products/stm32g491cet6/stmicroelectronics?region=nac; Height: 1.6mm
IC3 IC4 = CMP-031-00025-3: Power MUX; pin to pad: 2>2+7; Manufacturer_Name: Texas Instruments; Datasheet Link: https://www.ti.com/lit/gpn/tps2116; Manufacturer_Part_Number: TPS2116DRLR; Design Item ID: TPS2116DRLR; Arrow Price/Stock: https://www.arrow.com/en/products/tps2116drlr/texas-instruments?region=nac; Mouser Price/Stock: https://www.mouser.co.uk/ProductDetail/Texas-Instruments/TPS2116DRLR?qs=aP1CjGhiNiGo3XAyXcVPaQ%3D%3D; Mouser Part Number: 595-TPS2116DRLR; Source: TempSchematics.schlib; Arrow Part Number: TPS2116DRLR; Height: 0.6mm
LED1-LED4 = KT-0805G: LED; Manufacturer_Name: Hubei KENTO Elec; Datasheet Link: https://jlcpcb.com/api/file/downloadByFileSystemAccessId/8639582106239348736; Height: 0.95mm; Manufacturer_Part_Number: KT-0805G
  LED1 LED3: JLCPCB Part #: C34499
  LED2 LED4: JLCPCB Part #: C2297
P1 = CMP-002-00755-1: WR-PHD Pin Header, THT, Vertical, pitch 2.54mm, 1 Row, 2P; Manufacturer: Wurth Elektronik; Withstanding Voltage: 500V; Working Voltage: 250V; Contact Resistance: 20mO; Rated Current: 3A; ComponentLink2URL: https://www.we-online.com/redexpert/spec/61300211121?ad; ComponentLink1URL: https://www.we-online.com/redexpert/article/61300211121?ad; Category: Board-to-Board Connectors; Manufacturer Part Number: 61300211121; ComponentLink2Description: Datasheet Link; ComponentLink1Description: Website Link; Number of Rows: 1; Pins: 2; Source: WR-PHD.SchLib; Design Item ID: 61300211121; Pin Count: 2; Orientation: Vertical; Pitch: 2.54mm; Component Type: Standard; Mount: Through Hole; Match Code: WR-PHD; Packaging: Bag; Operating Temperature Min: -40°C; Gender: Pin Header; Operating Temperature Max: 105°C
PS1 = K7805-500R3: Power Supply; Manufacturer_Name: EVISUN; Height: 10.41mm; Manufacturer_Part_Number: K7805-500R3; JLCPCB Part #: C19188491
PS2 = XC6206P332MR-G: Power Supply; Manufacturer_Name: Torex; Datasheet Link: https://www.torexsemi.com/file/xc6206/XC6206.pdf; Height: 1.3mm; Manufacturer_Part_Number: XC6206P332MR-G; Mouser Part Number: 865-XC6206P332MR-G; Mouser Price/Stock: https://www.mouser.co.uk/ProductDetail/Torex-Semiconductor/XC6206P332MR-G?qs=AsjdqWjXhJ%2FXxNpRY3zZ8g%3D%3D
PS3 = WRB1203S-3WR2: Power Supply; Manufacturer_Name: EVISUN; Datasheet Link: https://jlc-prod-smt.oss-eu-central-1.aliyuncs.com/smtDataManualFile/8763072730084188160-C22437321.pdf?response-content-disposition=attachment%3B%20filename%3DC22437321.pdf%3B%20filename%2A%3DUTF-8%27%27C22437321.pdf&x-oss-date=20260715T193454Z&x-oss-expires=3600&x-oss-security-token=CAISgAN1q6Ft5B2yfSjIr5vGB4%2FWvadn2vqmc1aEsUE0QuZpjqjbpjz2IHhMdHJsAOodtv0%2FmmhT6PkclqRLcbhpcmfjV%2BZHzLB8qZ1MhF5f4J7b16cNrbH4M4H6aXeirtuwDsz9SNTCALjPD3nPii50x5bjaDymRCbLGJaViJlhHLN1Ow6jdmhpCctxLAlvo9NgFxm3D%2Fu2NQPwiWf9FVdhvhEG6Vly8qOi2MaRmFy8yFTx0b0SvJ%2BjYMrmPctoN9JnSdC5mfdzau3a1TJ84gRD0a5wkaVA1zbDs5bfISEIuUzebreLqY03dV4mOvdqIcMe8qigz88fk%2FfIioH6xyxKOexoSCnFTOiiupCcQLPyao9jLu6iayqViY7QaIOTqQohZmkAMwVOasAsI3Ngh4zF97Qt0cVNkXO9gWfLI8DtuMleWgprXccO%2BnSgc5lCkRRYwGs1287ugXlSQzo890KPDAEovaKCnZ2ZSfh7Y4sNknI6i%2Bfc2Se2MIkIyKE0YqKWD5sagAECs9NCpk8KgfXfWYxhKhKZsha9ngqEXyXXVVOpb2GGT6djF3S%2FLTKh30%2B6uTt7oH6XhzPlB7WR%2Fa7FsvHfaJ62Hu2KaBZEBf7KJcteyMD33hzIrNZl9%2F9XvPXuCryTgxV1ie4rkrvTaUkWCQr%2BRp6R1%2FN9Ic7TFTQ1orsPZrHwHCAA&x-oss-signature-version=OSS4-HMAC-SHA256&x-oss-credential=STS.NXsL5bPxFm8Mqp5UAaNiEampD%2F20260715%2Feu-central-1%2Foss%2Faliyun_v4_request&x-oss-signature=73c165591a835ffcff11ee9ad605e23bde33f7af0c5ec7bf6709df0808843322; Height: 12.25mm; Manufacturer_Part_Number: WRB1203S-3WR2; JLCPCB Part #: C22437321
PS4 = CMP-04917-000028-1: IC REG LINEAR 3.3V 1A SOT23-5; Manufacturer: Texas Instruments; Standoff Height: 0mm; Min Supply Voltage: 1.45V; Dropout Voltage: 1350mV; Output Type: Fixed; Max Junction Temp: +125°C; Max Supply Voltage: 5.5V; Number Of Outputs: 1; Accuracy Percentage: 1%; Manufacturer Part Number: TLV75733PDBVR; ComponentLink2Description: Datasheet; Temperature: -40°C to +125°C; RoHS: TRUE; ComponentLink2URL: http://www.ti.com/lit/ds/symlink/tlv757p.pdf; Output Voltage: 3.3V; Mouser Description: 1-A low-IQ small-size low-dropout (LDO) regulator 5-SOT-23 -40 to 125; Ipc Land Pattern Name: SOT95P280X145-5; Device Class L2: Power Management ICs; Package: DBV0005A; Height: 1.45mm; Category: IC; Digikey Description: IC REG LINEAR 3.3V 1A SOT23-5; Temperature Range High: +125°C; Octopart: https://octopart.com/tlv75733pdbvr-texas+instruments-91437073; Temperature Range Low: -40°C; Device Class L3: Voltage Regulators - Linear; Output Current: 1A; Device Class L1: Integrated Circuits (ICs); Automotive: No; Lead Free: Yes
R7 R8 R10 R12-R15 = CMP-009-00204-17: as R1 on sheet STM32_IO; Case/Package: 0402; Mounting Technology: SMD; Design Item ID: RES 0402; Source: Passives.SchLib; Tolerance: 1%
  R7 R8: JLCPCB Part #: C25752
  R10 R13: JLCPCB Part #: C25741
  R12: JLCPCB Part #: C25779
  R14: JLCPCB Part #: C25794
  R15: JLCPCB Part #: C25900
R9 R69 = CMP-009-00208-3: as R6 on sheet STM32_IO; Tolerance: 1%; Case/Package: 1206; Mounting Technology: SMD
  R9: JLCPCB Part #: DNP
  R69: JLCPCB Part #: C17927
R17 R18 = CMP-009-00206-3: as R4 on sheet STM32_IO; Case/Package: 0603; Tolerance: 1%; Mounting Technology: SMD; JLCPCB Part #: C22790
TP1-TP6 TP8-TP10 = CMP-00030-00001-7: Design Item ID: GTT_ProbeerPunt; Source: GTT_MainComponentLibrary.SchLib
U1 = CR2032-BS-6-1: Undefined or Miscellaneous; Manufacturer_Name: Q&J; Datasheet Link: https://datasheet.lcsc.com/szlcsc/Q-J-CR2032-BS-6-1_C70377.pdf; Height: 6mm; Manufacturer_Part_Number: CR2032-BS-6-1

## Sheet Transceivers.SchDoc: Transceivers
size A3; CompanyName: Green Team Twente; Organization: Green Team Twente; Revision: V1.1; SheetNumber: 6; SheetTotal: 10; Team: 2024; Subsystem: Embedded Systems; SPICEModelCacheTCQGJEKV: <root> / <DocumentId>TCQGJEKV</DocumentId> / </root>
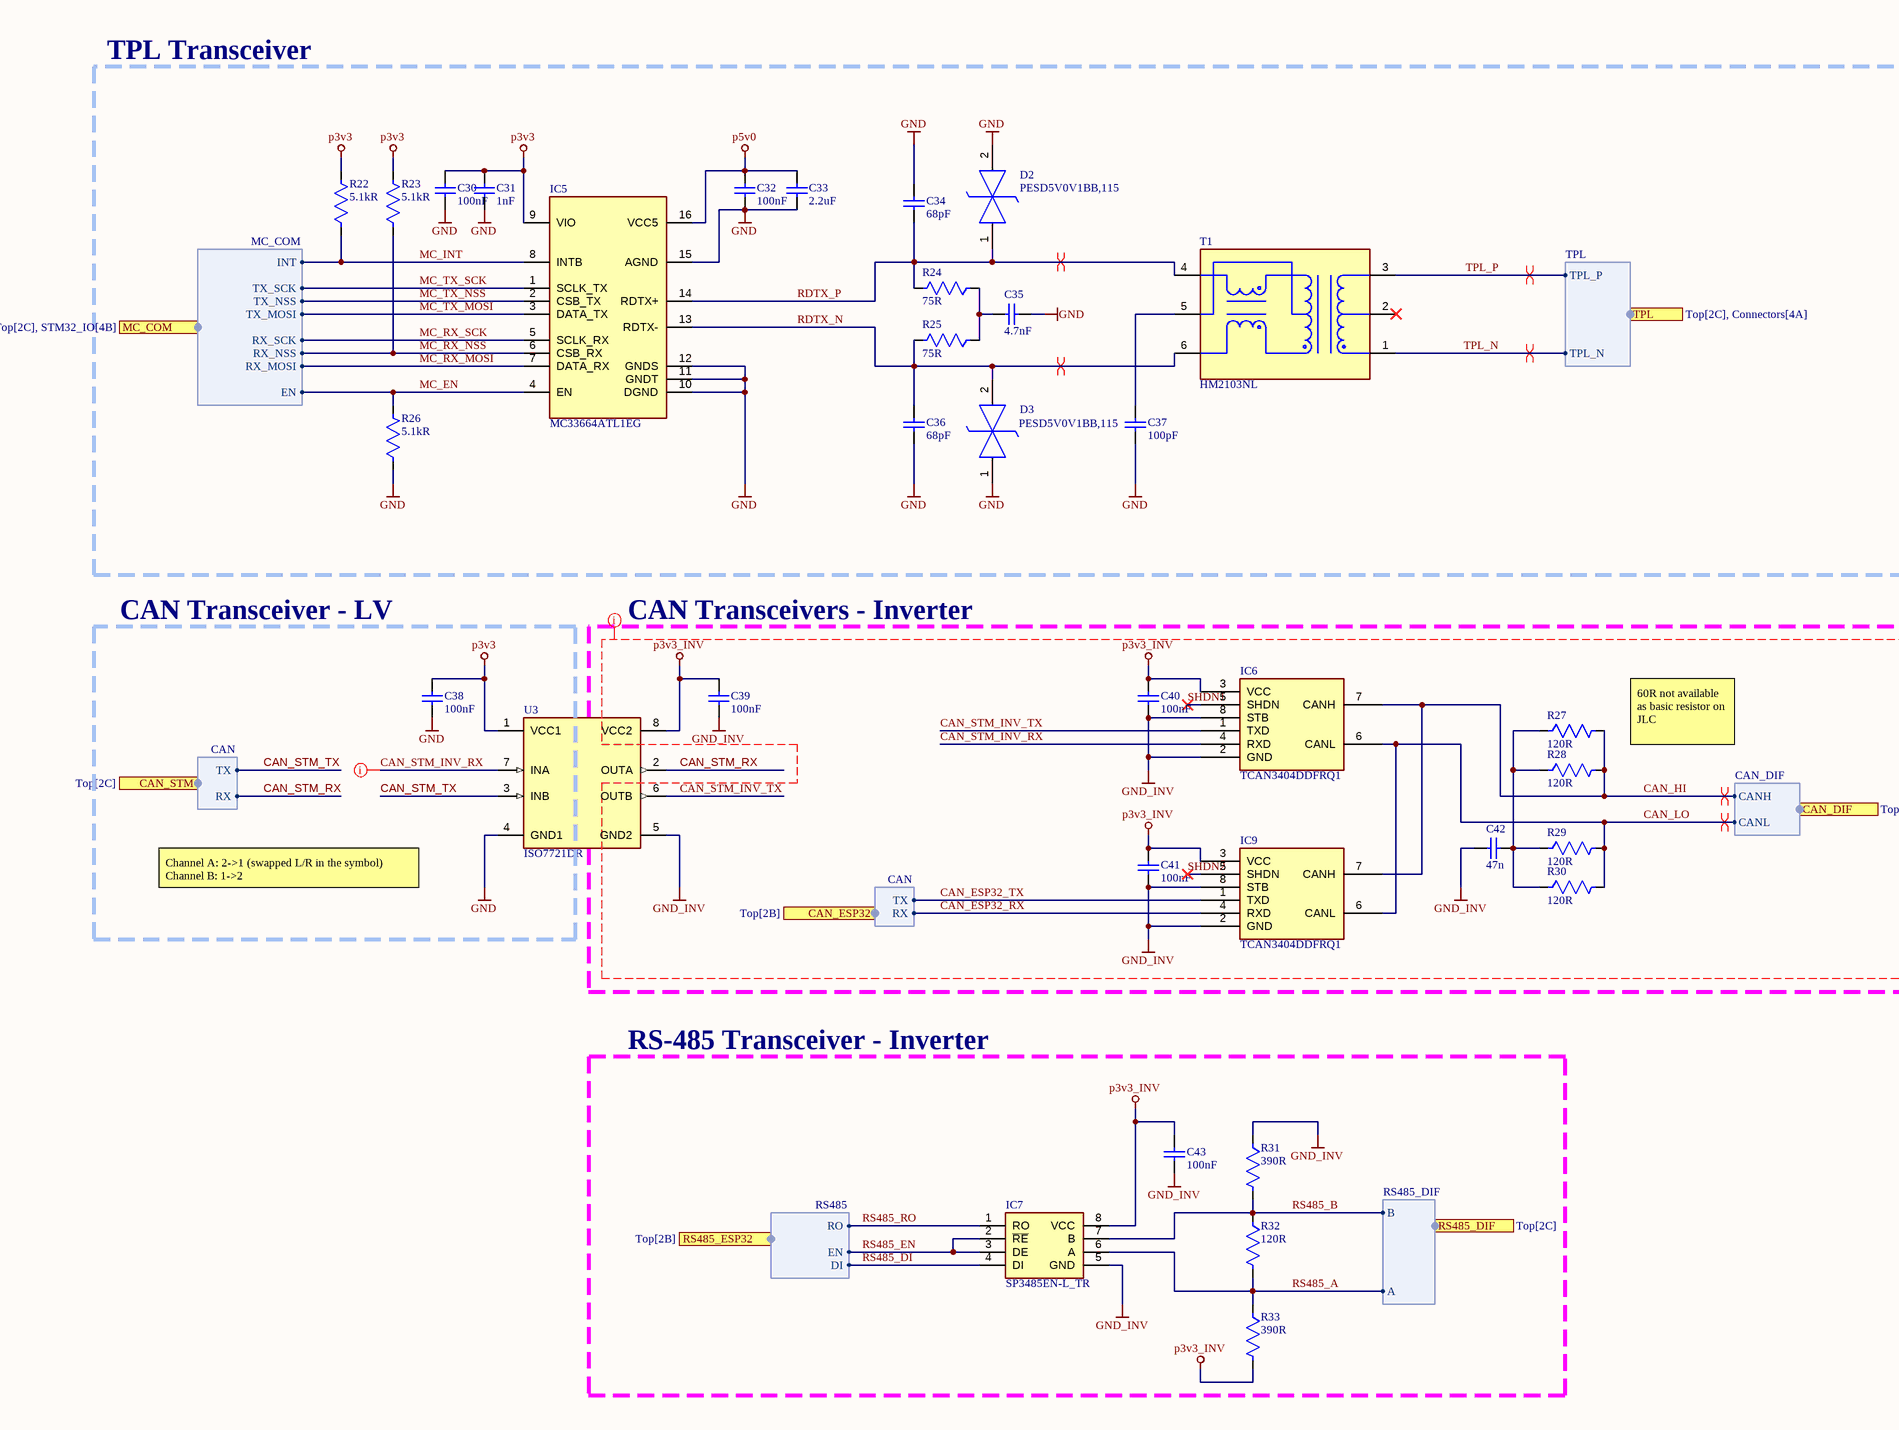
[diagram p4: Transceivers.SchDoc, left]
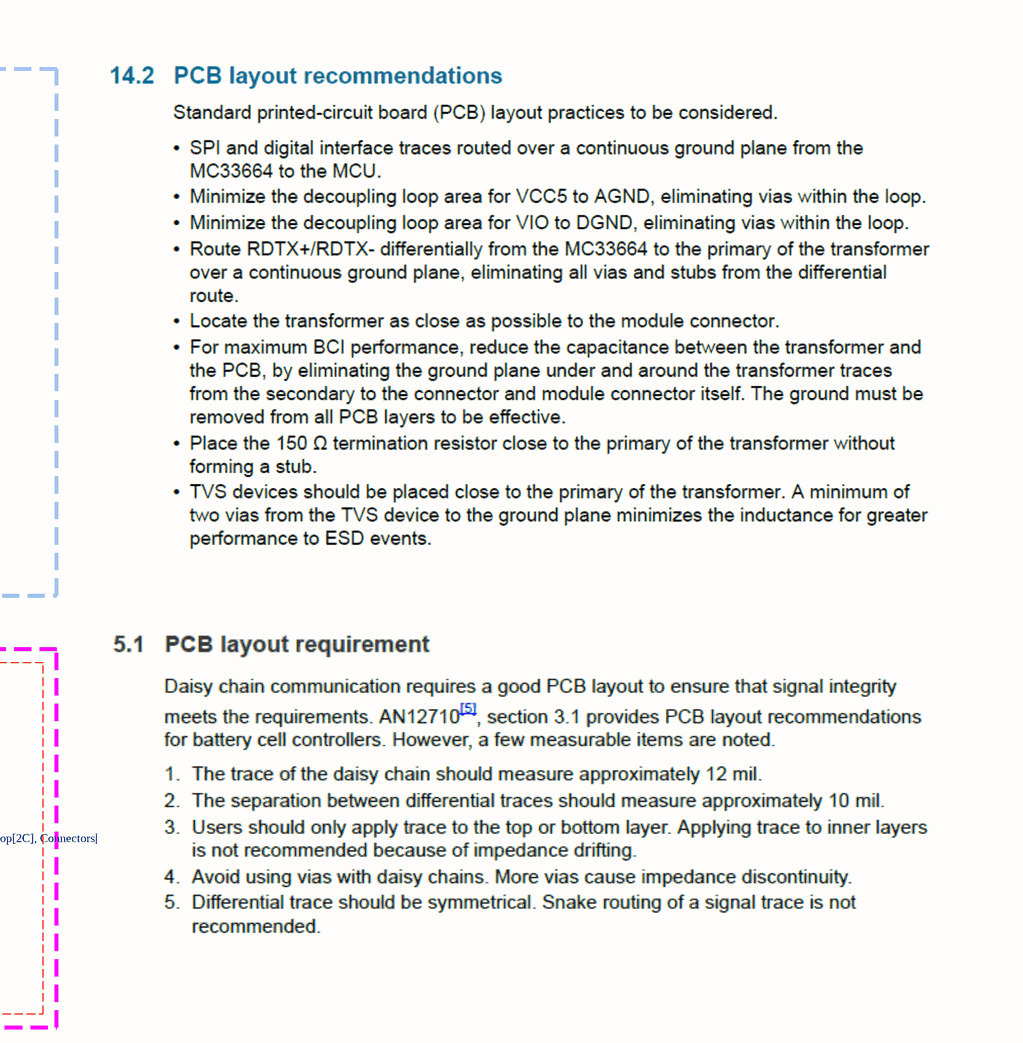
[diagram p5: Transceivers.SchDoc, right]

### Parts
C30  value 100nF  [WCAP-CSGP_0402_L1W0.5H0.5]  (hidden comment: CAP 0402 100nF X7R)
C31  value 1nF  [WCAP-CSGP_0402_L1W0.5H0.5]  (hidden comment: CAP 0402 1nF X7R)
C32  value 100nF  [WCAP-CSGP_0402_L1W0.5H0.5]  (hidden comment: CAP 0402 100nF X7R)
C33  value 2.2uF  [WCAP-CSGP_0603_L1.6W0.8H0.8_Reflow]  (hidden comment: CAP 0603 2.2uF X7R)
C34  value 68pF  [WCAP-CSGP_0402_L1W0.5H0.5]  (hidden comment: CAP 0402 68pF X7R)
C35  value 4.7nF  [WCAP-CSGP_0402_L1W0.5H0.5]  (hidden comment: CAP 0402 4.7nF X7R)
C36  value 68pF  [WCAP-CSGP_0402_L1W0.5H0.5]  (hidden comment: CAP 0402 68pF X7R)
C37  value 100pF  [WCAP-CSGP_0402_L1W0.5H0.5]  (hidden comment: CAP 0402 100pF X7R)
C38  value 100nF  [WCAP-CSGP_0402_L1W0.5H0.5]  (hidden comment: CAP 0402 100nF X7R)
C39  value 100nF  [WCAP-CSGP_0402_L1W0.5H0.5]  (hidden comment: CAP 0402 100nF X7R)
C40  value 100nF  [WCAP-CSGP_0402_L1W0.5H0.5]  (hidden comment: CAP 0402 100nF X7R)
C41  value 100nF  [WCAP-CSGP_0402_L1W0.5H0.5]  (hidden comment: CAP 0402 100nF X7R)
C42  value 47n  [WCAP-CSGP_0603_L1.6W0.8H0.8_Reflow]  (hidden comment: CAP 0603 47n X7R)
C43  value 100nF  [WCAP-CSGP_0402_L1W0.5H0.5]  (hidden comment: CAP 0402 100nF X7R)
D2  PESD5V0V1BB,115  [PESD5V0V1BB115]
D3  PESD5V0V1BB,115  [PESD5V0V1BB115]
IC5  MC33664ATL1EG  [SOIC127P600X175-16N]
IC6  TCAN3404DDFRQ1  [TSOT-23-8]
IC7  SP3485EN-L_TR  [SOIC127P600X175-8N]
IC9  TCAN3404DDFRQ1  [TSOT-23-8]
R22  value 5.1kR  [FP0402]  (hidden comment: RES 0402 5.1kR 1%)
R23  value 5.1kR  [FP0402]  (hidden comment: RES 0402 5.1kR 1%)
R24  value 75R  [RES_SM0603_YAGEORC_N]  (hidden comment: RES 0603 75R 1%)
R25  value 75R  [RES_SM0603_YAGEORC_N]  (hidden comment: RES 0603 75R 1%)
R26  value 5.1kR  [FP0402]  (hidden comment: RES 0402 5.1kR 1%)
R27  value 120R  [RES_SM0603_YAGEORC_N]  (hidden comment: RES 0603 120R 1%)
R28  value 120R  [RES_SM0603_YAGEORC_N]  (hidden comment: RES 0603 120R 1%)
R29  value 120R  [RES_SM0603_YAGEORC_N]  (hidden comment: RES 0603 120R 1%)
R30  value 120R  [RES_SM0603_YAGEORC_N]  (hidden comment: RES 0603 120R 1%)
R31  value 390R  [RES_SM0603_YAGEORC_N]  (hidden comment: RES 0603 390R 1%)
R32  value 120R  [RES_SM0603_YAGEORC_N]  (hidden comment: RES 0603 120R 1%)
R33  value 390R  [RES_SM0603_YAGEORC_N]  (hidden comment: RES 0603 390R 1%)
T1  HM2103NL  [FP-HM2103NL-MFG]
U3  ISO7721DR  [FP-D0008B-MFG]

### Blocks framed on the sheet
TPL Transceiver: C30-C37 D2 D3 IC5 R22-R26 T1
CAN Transceiver - LV: C38
CAN Transceivers - Inverter: C39-C42 IC6 IC9 R27-R30
RS-485 Transceiver - Inverter: C43 IC7 R31-R33

### Ports
CAN_DIF (out, harness CAN_DIF, see Top[2C], Connectors[1A]), CAN_ESP32 (out, harness CAN, see Top[2B]), CAN_STM (out, harness CAN, see Top[2C]), MC_COM (out, harness MC_COM, see Top[2C], STM32_IO[4B]), RS485_DIF (out, harness RS485_DIF, see Top[2C]), RS485_ESP32 (out, harness RS485, see Top[2B]), TPL (out, harness TPL, see Top[2C], Connectors[4A])

### Harnesses
CAN: RX, TX
MC_COM: INT, TX_SCK, TX_NSS, TX_MOSI, RX_SCK, RX_NSS, RX_MOSI, EN
CAN_DIF: CANH, CANL
TPL: TPL_P, TPL_N
CAN: TX, RX
RS485_DIF: A, B
RS485: RO, EN, DI

### Nets
GND: C30.1 C31.1 C32.1 C33.1 C34.2 C35.1 C36.1 C37.1 C38.1 D2.2(K2) D3.1(K1) IC5.10(DGND) IC5.11(GNDT) IC5.12(GNDS) IC5.15(AGND) R26.1 U3.4(GND1)
GND_INV: C39.1 C40.1 C41.1 C42.2 C43.1 IC6.2(GND) IC6.8(STB) IC7.5(GND) IC9.2(GND) IC9.8(STB) R31.1 U3.5(GND2)
p3v3: C30.2 C31.2 C38.2 IC5.9(VIO) R22.2 R23.2 U3.1(VCC1)
p3v3_INV: C39.2 C40.2 C41.2 C43.2 IC6.3(VCC) IC7.8(VCC) IC9.3(VCC) R33.2 U3.8(VCC2)
p5v0: C32.2 C33.2 IC5.16(VCC5)
CAN_ESP32_RX: IC9.4(RXD) ; port CAN_ESP32.RX
CAN_ESP32_TX: IC9.1(TXD) ; port CAN_ESP32.TX
CAN_HI: IC6.7(CANH) IC9.7(CANH) R27.2 R28.2 ; port CAN_DIF.CANH
CAN_LO: IC6.6(CANL) IC9.6(CANL) R29.2 R30.2 ; port CAN_DIF.CANL
CAN_STM_INV_RX: IC6.4(RXD) U3.7(INA)
CAN_STM_INV_TX: IC6.1(TXD) U3.6(OUTB)
CAN_STM_RX: U3.2(OUTA) ; port CAN_STM.RX  [project net CAN_RX]
CAN_STM_TX: U3.3(INB) ; port CAN_STM.TX
MC_EN: IC5.4(EN) R26.2 ; port MC_COM.EN
MC_INT: IC5.8(INTB) R22.1 ; port MC_COM.INT
MC_RX_MOSI: IC5.7(DATA_RX) ; port MC_COM.RX_MOSI
MC_RX_NSS: IC5.6(CSB_RX) R23.1 ; port MC_COM.RX_NSS
MC_RX_SCK: IC5.5(SCLK_RX) ; port MC_COM.RX_SCK
MC_TX_MOSI: IC5.3(DATA_TX) ; port MC_COM.TX_MOSI
MC_TX_NSS: IC5.2(CSB_TX) ; port MC_COM.TX_NSS
MC_TX_SCK: IC5.1(SCLK_TX) ; port MC_COM.TX_SCK
RDTX_N: C36.2 D3.2(K2) IC5.13(RDTX-) R25.2 T1.6
RDTX_P: C34.1 D2.1(K1) IC5.14(RDTX+) R24.2 T1.4
RS485_A: IC7.6(A) R32.2 R33.1 ; port RS485_DIF.A  [project net A]
RS485_B: IC7.7(B) R31.2 R32.1 ; port RS485_DIF.B  [project net B]
RS485_DI: IC7.4(DI) ; port RS485_ESP32.DI
RS485_EN: IC7.2(~{RE}) IC7.3(DE) ; port RS485_ESP32.EN
RS485_RO: IC7.1(RO) ; port RS485_ESP32.RO
SHDN1: IC6.5(SHDN)
SHDN2: IC9.5(SHDN)
TPL_N: T1.1 ; port TPL.TPL_N
TPL_P: T1.3 ; port TPL.TPL_P
NetC35_2: C35.2 R24.1 R25.1
NetC37_2: C37.2 T1.5
NetC42_1: C42.1 R27.1 R28.1 R29.1 R30.1

Not connected (* = marked no-connect by the designer): T1 2*

### Layout directives
differential pair; differential pair class CAN120; rule Clearance Constraint [Generic clearance = 0.15mm, and 12 value(s) for objects]: CAN_HI, CAN_LO
differential pair; differential pair class TPL100; rule Clearance Constraint [Generic clearance = 0.15mm, and 12 value(s) for objects]: RDTX_N, RDTX_P, TPL_N, TPL_P
net class INV: CAN_ESP32_RX, CAN_ESP32_TX, CAN_HI, CAN_LO, CAN_STM_INV_RX, CAN_STM_INV_TX, GND_INV, p3v3_INV, SHDN1, SHDN2

### Notes on the sheet
- 60R not available as basic resistor on JLC
- Channel A: 2->1 (swapped L/R in the symbol)
  Channel B: 1->2
- Team
- Authors
- Revision
- Title
- Project
- Subsystem
- File
- Sheet
- //

### Library data of the parts
C30-C32 C34-C41 C43 = CMP-001-01308-5: as C1 on sheet STM32_IO; Pins: 2; Case/Package: 0402; Category: Multilayer Ceramic Chip Capacitors; Ceramic Type: X7R; ClassName: TPL_Trans
  C30 C32 C38-C41 C43: JLCPCB Part #: C1525
  C31: JLCPCB Part #: C1523
  C34 C36: JLCPCB Part #: C190580
  C35: JLCPCB Part #: C1538
  C37: JLCPCB Part #: C1546
C33 C42 = CMP-001-01309-1: as C2 on sheet STM32_IO; Case/Package: 0603; Category: Multilayer Ceramic Chip Capacitors; Ceramic Type: X7R; Pins: 2
  C33: ClassName: TPL_Trans; JLCPCB Part #: C23630
  C42: JLCPCB Part #: C1622
D2 D3 = CMP-004-00097-1: PESD5V0V1BB - Very low capacitance bidirectional ESD protection diode; Manufacturer_Name: Nexperia; Arrow Price/Stock: https://www.arrow.com/en/products/pesd5v0v1bb115/nexperia?region=nac; Design Item ID: PESD5V0V1BB,115; Height: 0.65mm; Manufacturer_Part_Number: PESD5V0V1BB,115; Mouser Price/Stock: https://www.mouser.co.uk/ProductDetail/Nexperia/PESD5V0V1BB115?qs=GcY6OjH1zdkfLKV5vNnV%252BA%3D%3D; Datasheet Link: https://assets.nexperia.com/documents/data-sheet/PESD5V0V1BB.pdf; Mouser Part Number: 771-PESD5V0V1BB115; Source: TempSchematics.schlib; Arrow Part Number: PESD5V0V1BB,115
IC5 = CMP-031-00034-2: Interface - Specialized Isolated network high speed transceiver; Manufacturer_Name: NXP; Height: 1.75mm; Source: TempSchematics.schlib; Arrow Part Number: MC33664ATL1EG; Mouser Part Number: 841-MC33664ATL1EG; Mouser Price/Stock: https://www.mouser.co.uk/ProductDetail/NXP-Semiconductors/MC33664ATL1EG?qs=ifm8N2KdrcYav8QSnSftXQ%3D%3D; Design Item ID: MC33664ATL1EG; Datasheet Link: http://www.nxp.com/docs/en/data-sheet/MC33664_SDS.pdf; Manufacturer_Part_Number: MC33664ATL1EG; Arrow Price/Stock: https://www.arrow.com/en/products/mc33664atl1eg/nxp-semiconductors?region=nac
IC6 IC9 = TCAN3404DDFRQ1: Integrated Circuit; Manufacturer_Name: TI; Datasheet Link: https://www.ti.com/lit/ds/symlink/tcan3404-q1.pdf; Height: 1.1mm; Manufacturer_Part_Number: TCAN3404DDFRQ1; JLCPCB Part #: C32428067
IC7 = SP3485EN-L_TR: Integrated Circuit; Manufacturer_Name: MaxLinear; Manufacturer_Part_Number: SP3485EN-L/TR; Datasheet Link: https://www.maxlinear.com/ds/sp3485.pdf; Height: 1.75mm; Mouser Part Number: 701-SP3485EN-L/TR; Mouser Price/Stock: https://www.mouser.co.uk/ProductDetail/MaxLinear/SP3485EN-L-TR?qs=3EMgrMjM0fbQ17liGrle%2Fg%3D%3D; Arrow Part Number: SP3485EN-L/TR; Arrow Price/Stock: https://www.arrow.com/en/products/sp3485en-ltr/maxlinear-inc?region=nac; JLCPCB Part #: C8963
R22 R23 R26 = CMP-009-00204-17: as R1 on sheet STM32_IO; Mounting Technology: SMD; Tolerance: 1%; Case/Package: 0402; Design Item ID: RES 0402; Source: Passives.SchLib; JLCPCB Part #: C25905
R24 R25 R27-R33 = CMP-009-00206-3: as R4 on sheet STM32_IO; Case/Package: 0603; Tolerance: 1%; Mounting Technology: SMD
  R24 R25: JLCPCB Part #: C4275
  R27-R30 R32: JLCPCB Part #: C22787
  R31 R33: JLCPCB Part #: C23151
T1 = CMP-16309-000039-1: XFMR CMC MODULE AECQ BATT MNGT; Obsolete Part: false; Manufacturer: Pulse; Isolation Voltage: 4300VDC; Automotive Grade: Grade 1; Turns Ratio: 1:1; Standoff Height: 0.13mm; Insertion Loss: 0.25dB; Return Loss: 20dB; Inductance Primary: 150uH; Device Class L2: Transformers; Automotive: Yes; RoHS: TRUE; Device Class L1: Passive Components; Digikey Description: XFMR CMC MODULE AECQ BATT MNGT; Package: 0; Manufacturer Part Number: HM2103NL; Height: 5.72mm; Temperature Range High: +125°C; Temperature Range Low: -40°C; Category: Trans; Temperature: -40°C to +125°C; Lead Free: Yes; ComponentLink2URL: https://productfinder.pulseeng.com/product/HM2103NL; Octopart: https://octopart.com/hm2103nl-pulse-87646222; Device Class L3: unset; ComponentLink2Description: Datasheet; ClassName: TPL_Trans; JLCPCB Part #: C962543
U3 = CMP-04872-000019-2: DGTL ISO 3KV GEN PRP 8SOIC; Isolated Power: No; Channel Type: Unidirectional; Pulse Width Distortion (PWD): 4.9ns; Propagation Delay: 16ns; Number of Channels: 2; Data Rate: 100Mbps; Case/Package: SOIC; Number of Pins: 8; Min Operating Temperature: -55°C; Max Operating Temperature: 125°C; Type: General Purpose; Packaging: Tape and Reel; Mount: Surface Mount

## Sheet Peripherals.SchDoc: Peripherals
size A3; CompanyName: Green Team Twente; Organization: Green Team Twente; Revision: V1.1; SheetNumber: 7; SheetTotal: 10; Team: 2024; Subsystem: Embedded Systems
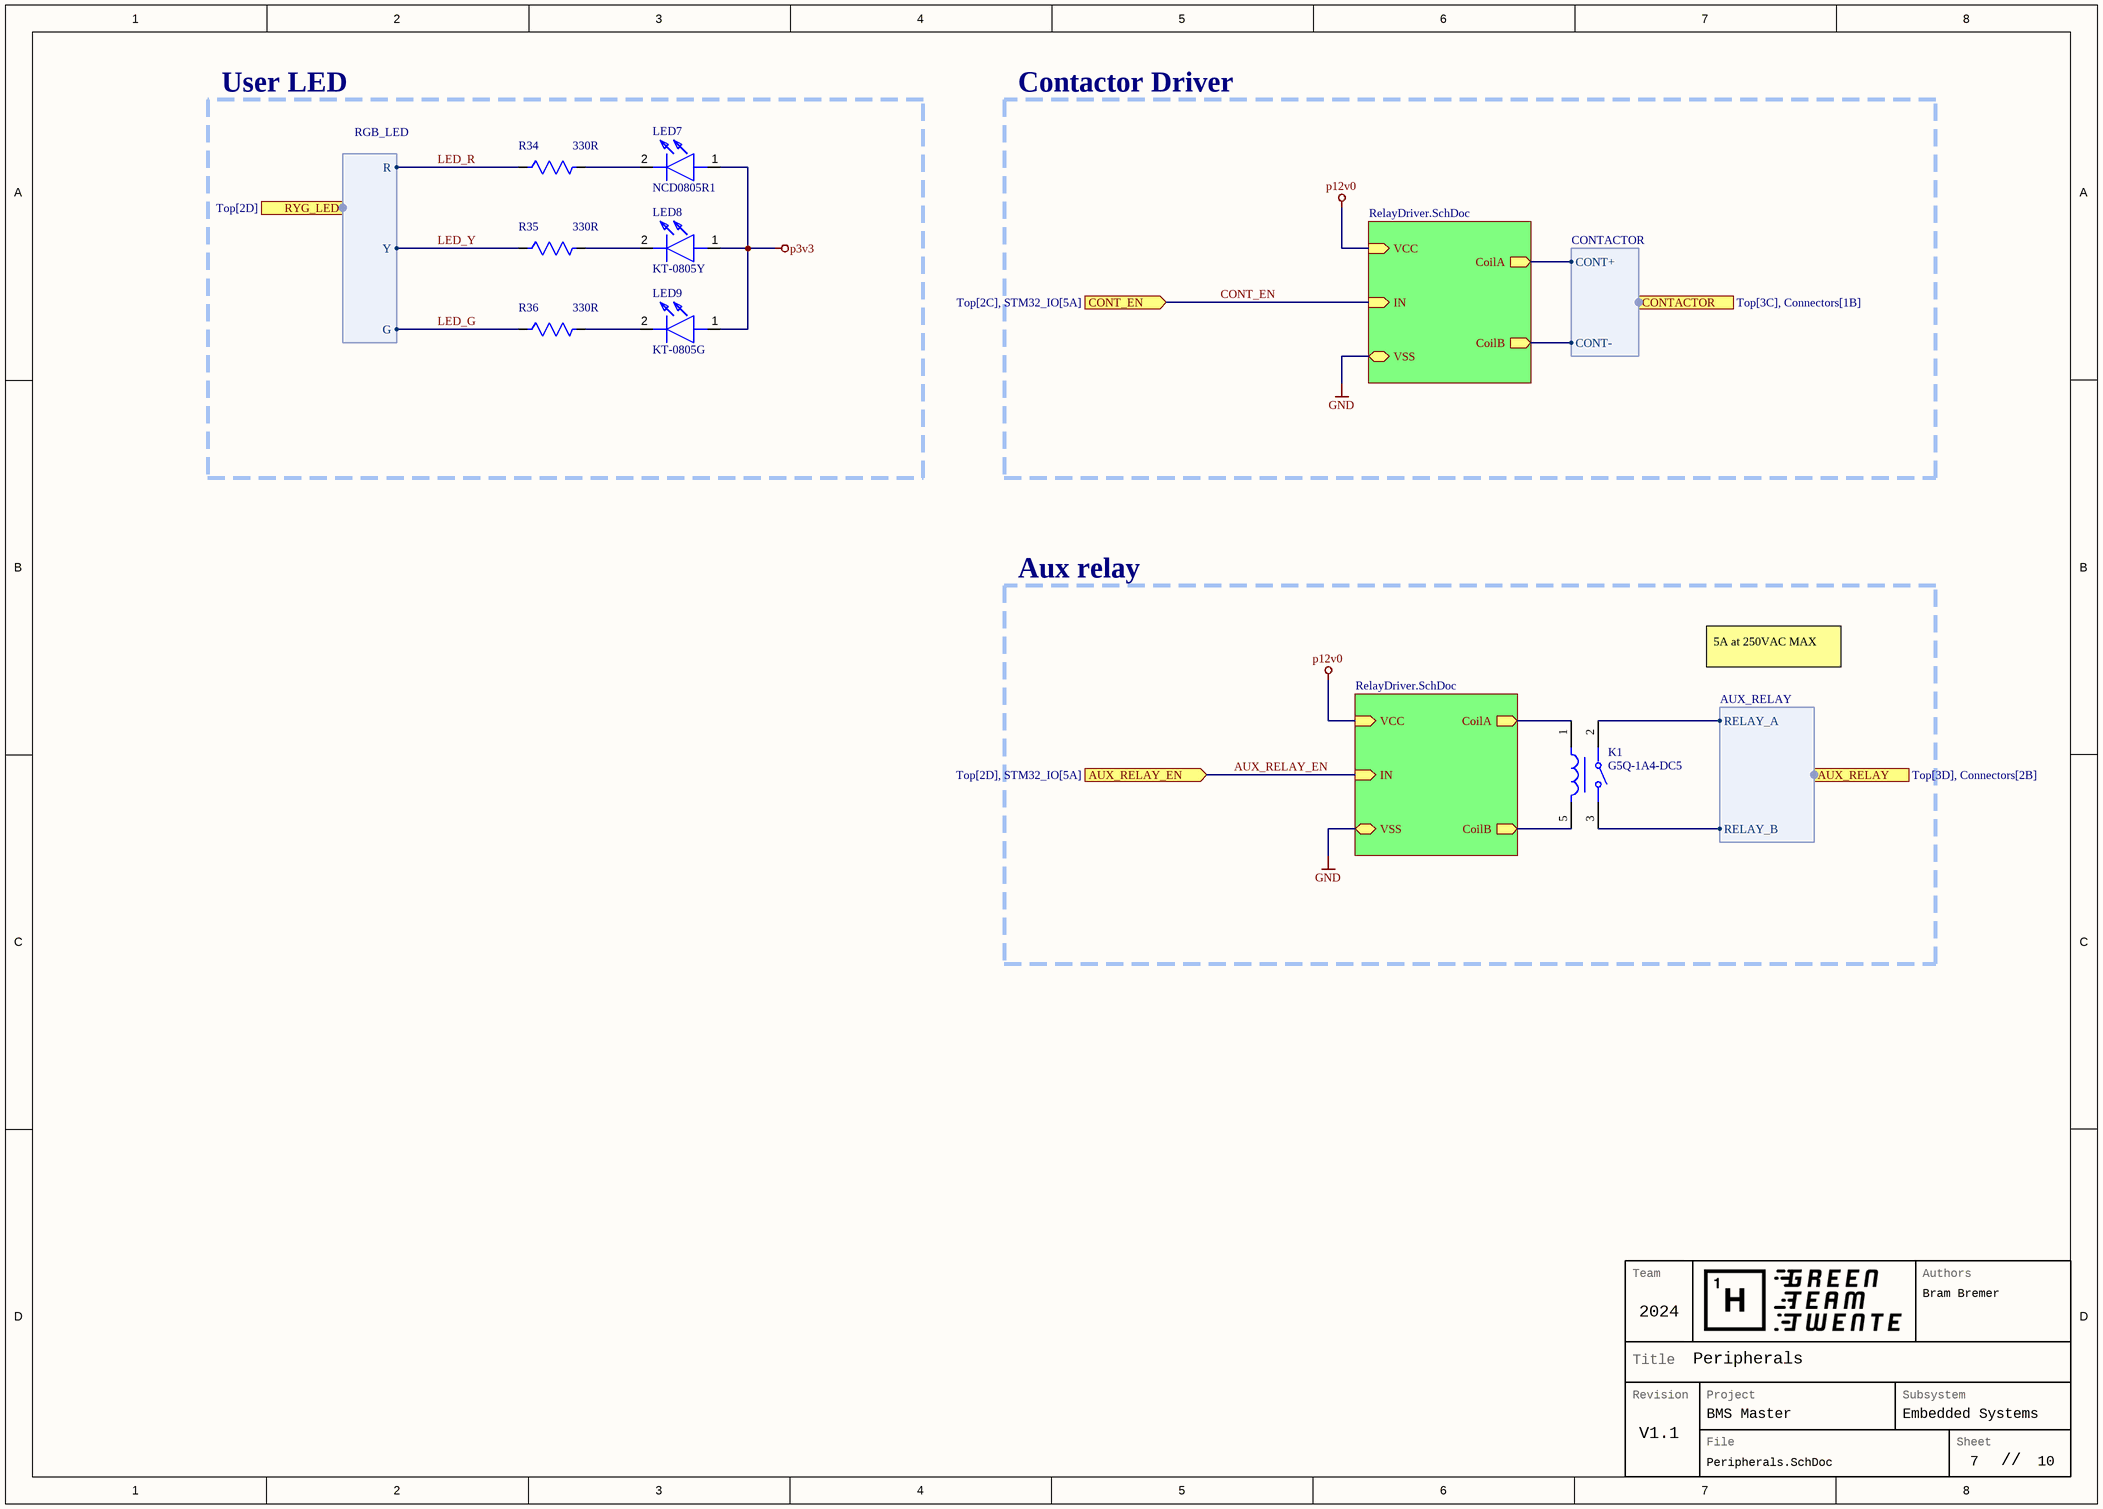
[diagram p6: Peripherals.SchDoc]

### Parts
K1  G5Q-1A4-DC5  [FP-G5Q-1A4-DC5-MFG]
LED7  NCD0805R1  [KT0805G]
LED8  KT-0805Y  [KT0805G]
LED9  KT-0805G  [KT0805G]
R34  value 330R  [RES_SM0603_YAGEORC_N]  (hidden comment: RES 0603 330R 1%)
R35  value 330R  [RES_SM0603_YAGEORC_N]  (hidden comment: RES 0603 330R 1%)
R36  value 330R  [RES_SM0603_YAGEORC_N]  (hidden comment: RES 0603 330R 1%)

### Blocks framed on the sheet
User LED: LED7-LED9 R34-R36
Aux relay: K1

### Sub-sheets
AuxRelay = RelayDriver.SchDoc: IN (in), VCC (in), VSS (bidir), CoilA (out), CoilB (out)
ContactorDriver = RelayDriver.SchDoc: IN (in), VCC (in), VSS (bidir), CoilA (out), CoilB (out)

### Ports
AUX_RELAY (out, harness AUX_RELAY, see Top[3D], Connectors[2B]), AUX_RELAY_EN (in, see Top[2D], STM32_IO[5A]), CONT_EN (in, see Top[2C], STM32_IO[5A]), CONTACTOR (out, harness CONTACTOR, see Top[3C], Connectors[1B]), RYG_LED (out, harness RGB_LED, see Top[2D])

### Harnesses
RGB_LED: G, Y, R
CONTACTOR: CONT+, CONT-
AUX_RELAY: RELAY_A, RELAY_B

### Nets
GND: sheet ContactorDriver/VSS, sheet AuxRelay/VSS
p3v3: LED7.1(A) LED8.1(A) LED9.1(A)
p12v0: K1.1 ; sheet ContactorDriver/VCC, sheet ContactorDriver/CoilA, sheet AuxRelay/VCC, sheet AuxRelay/CoilA, port CONTACTOR.CONT+
AUX_RELAY_EN: port AUX_RELAY_EN, sheet AuxRelay/IN
CONT_EN: port CONT_EN, sheet ContactorDriver/IN
CONTACTOR-: sheet ContactorDriver/CoilB, port CONTACTOR.CONT-
LED_G: R36.1 ; port RYG_LED.G
LED_R: R34.1 ; port RYG_LED.R
LED_Y: R35.1 ; port RYG_LED.Y
RELAY_A: K1.2 ; port AUX_RELAY.RELAY_A
RELAY_B: K1.3 ; port AUX_RELAY.RELAY_B
NetD6_AuxRelay_2: K1.5 ; sheet AuxRelay/CoilB
NetLED7_2: LED7.2(K) R34.2
NetLED8_2: LED8.2(K) R35.2
NetLED9_2: LED9.2(K) R36.2

### Notes on the sheet
- Contactor Driver
- 5A at 250VAC MAX
- Team
- Authors
- Revision
- Title
- Project
- Subsystem
- File
- Sheet
- //

### Library data of the parts
K1 = CMP-08822-000148-1: RELAY GEN PURPOSE SPST 10A 5V; Relay Type: General Purpose; Operate Time: 10ms; Approvals: UL; Voltage Rating (AC): 277V; Max Voltage Rating (DC): 30V; Power Consumption: 2mW; Coil Current: 40mA; Release Time: 5ms; Coil Type: Non-Latching; Coil Power: 200mW; Coil Resistance: 125R; Max Current Rating: 10A; Number of Pins: 4; Termination: PC Pin; Packaging: Bulk; Length: 20.3mm; Radiation Hardening: No; Throw Configuration: SPST; Mount: Through Hole; Max Voltage Rating (AC): 277V; Contact Material: Silver; Min Operating Temperature: -40°C; Current Rating: 10A; Max Operating Temperature: 105°C; Contact Current Rating: 10A; Package Quantity: 400; Series: G5Q; Coil Voltage (DC): 5V; Depth: 10.3mm; Weight: 6.5g
LED7-LED9 = KT-0805G: LED; Manufacturer_Name: Hubei KENTO Elec; Datasheet Link: https://jlcpcb.com/api/file/downloadByFileSystemAccessId/8639582106239348736; Height: 0.95mm; Manufacturer_Part_Number: KT-0805G
  LED7: JLCPCB Part #: C84256
  LED8: JLCPCB Part #: C2296
  LED9: JLCPCB Part #: C2297
R34-R36 = CMP-009-00206-3: as R4 on sheet STM32_IO; Case/Package: 0603; Tolerance: 1%; Mounting Technology: SMD; JLCPCB Part #: C23138

## Sheet RelayDriver.SchDoc
size A4; CompanyName: Hydriven; Organization: Hydriven; Revision: V1.1; SheetNumber: 8; SheetTotal: 10; Team: 2025; Subsystem: Embedded Systems
Used 2 times, as channels Peripherals/ContactorDriver, Peripherals/AuxRelay. Parts and nets are listed once, with the designators drawn on the sheet.
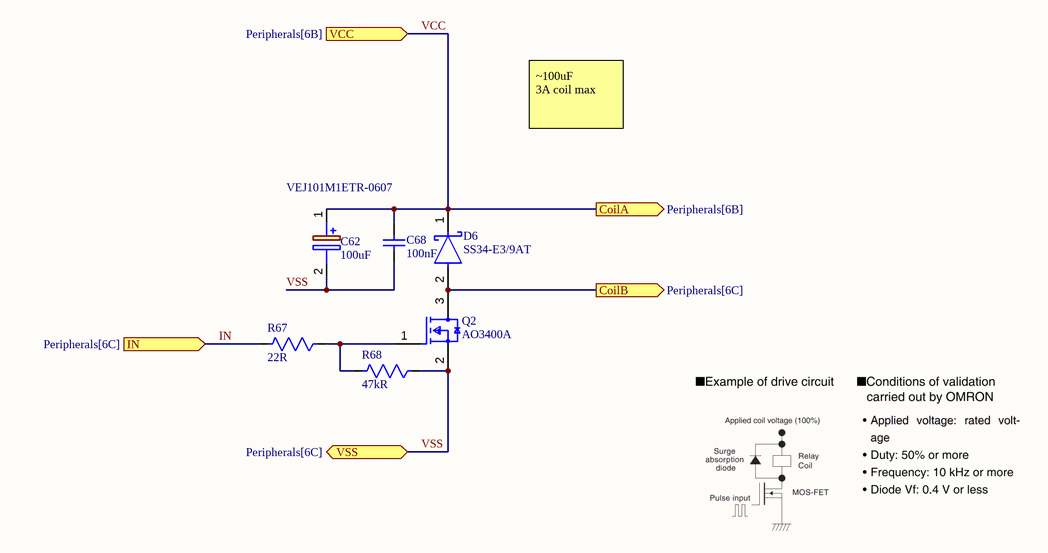
[diagram p7: RelayDriver.SchDoc]

### Parts
C62  VEJ101M1ETR-0607  value 100uF  [CAPAE660X800N]
C68  value 100nF  [WCAP-CSGP_0402_L1W0.5H0.5]  (hidden comment: CAP 0402 100nF X7R)
D6  SS34-E3/9AT  [FP-SMC-MFG]
Q2  AO3400A  [FP-SOT23-MFG]
R67  value 22R  [RES_SM0603_YAGEORC_N]  (hidden comment: RES 0603 22R 1%)
R68  value 47kR  [RES_SM0603_YAGEORC_N]  (hidden comment: RES 0603 47kR 1%)

### Ports
CoilA (out, see Peripherals[6B]), CoilB (out, see Peripherals[6C]), IN (in, see Peripherals[6C]), VCC (in, see Peripherals[6B]), VSS (bidir, see Peripherals[6C])

### Nets
CoilB: D6.2(A) Q2.3(D) ; port CoilB
IN: R67.2 ; port IN
VCC: C62.1(+) C68.2 D6.1(C) ; port VCC, port CoilA
VSS: C62.2(-) C68.1 Q2.2(S) R68.1 ; port VSS
NetQ2_1: Q2.1(G) R67.1 R68.2

### Channels
Peripherals/ContactorDriver: designators end in _ContactorDriver; ports CoilA=p12v0 CoilB=CONTACTOR- IN=CONT_EN VCC=p12v0 VSS=GND
Peripherals/AuxRelay: designators end in _AuxRelay; ports CoilA=p12v0 CoilB=NetD6_AuxRelay_2 IN=AUX_RELAY_EN VCC=p12v0 VSS=GND

### Notes on the sheet
- ~100uF
  3A coil max
- Team
- Authors
- Revision
- Title
- Project
- Subsystem
- File
- Sheet
- //

### Library data of the parts
C62 = VEJ101M1ETR-0607: as C23 on sheet Power; Datasheet Link: https://www.mouser.de/datasheet/2/231/161587198639-2307150.pdf; Height: 8mm; Manufacturer_Part_Number: VEJ101M1ETR-0607; JLCPCB Part #: C176664
C68 = CMP-001-01308-5: as C1 on sheet STM32_IO; Pins: 2; Case/Package: 0402; Category: Multilayer Ceramic Chip Capacitors; Ceramic Type: X7R; JLCPCB Part #: C1525
D6 = CMP-02539-000066-1: DIODE SCHOTTKY 40V 3A DO214AB; Peak Non-Repetitive Surge Current: 100A; Forward Voltage: 500mV; Element Configuration: Single; Max Reverse Current: 500uA; Case/Package: SMC; Radiation Hardening: No; Series: -; Max Surge Current: 100A; RoHS Compliant: Yes; Min Operating Temperature: -55°C; Average Rectified Current: 3A; Max Reverse Leakage Current: 500uA; Package Quantity: 3500; Max Reverse Voltage (DC): 40V; Forward Current: 3A; Packaging: Tape and Reel; Max Operating Temperature: 125°C; Max Repetitive Reverse Voltage (Vrrm): 40V; Number of Pins: 2; Mount: Surface Mount; JLCPCB Part #: C3008890
Q2 = CMP-83955-000006-1: MOSFET N-CH 30V 5.7A SOT23; Input Capacitance: 630pF; Number of Elements: 1; Rds On Max: 26.5mR; Max Power Dissipation: 1.4W; Gate to Source Voltage (Vgs): 12V; Min Operating Temperature: -55°C; Lead Free: Lead Free; Number of Pins: 3; Drain to Source Voltage (Vdss): 30V; Case/Package: SOT-23; Mount: Surface Mount; Continuous Drain Current (ID): 5.7A; Radiation Hardening: No; Packaging: Tape and Reel; Max Operating Temperature: 150°C; Power Dissipation: 1.4W
R67 R68 = CMP-009-00206-3: as R4 on sheet STM32_IO; Case/Package: 0603; Tolerance: 1%; Mounting Technology: SMD
  R67: JLCPCB Part #: C23345
  R68: JLCPCB Part #: C25819

## Sheet Connectors.SchDoc: Connectors
size A4; CompanyName: Green Team Twente; Organization: Green Team Twente; Revision: V1.1; SheetNumber: 9; SheetTotal: 10; Team: 2024; Subsystem: Embedded Systems
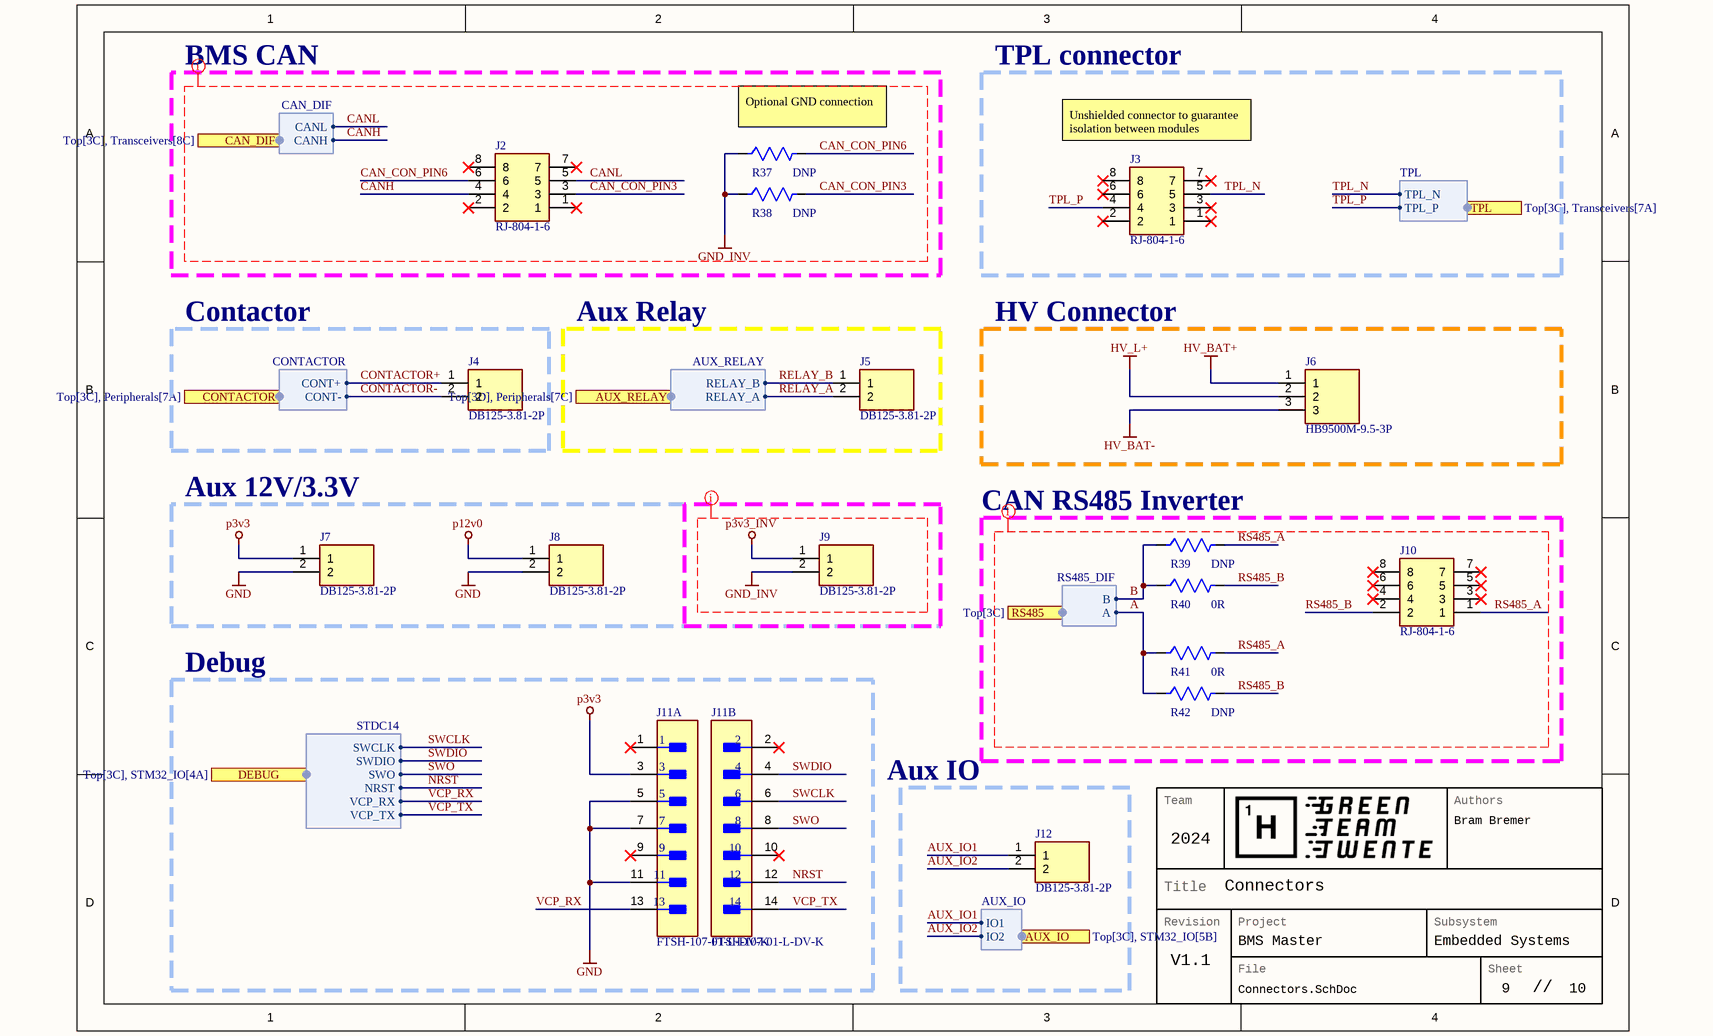
[diagram p8: Connectors.SchDoc]

### Parts
J2  RJ-804-1-6  [RJ80416]
J3  RJ-804-1-6  [RJ80416]
J4  DB125-3.81-2P  [SHDR2W80P0X381_1X2_802X740X880P]
J5  DB125-3.81-2P  [SHDR2W80P0X381_1X2_802X740X880P]
J6  HB9500M-9.5-3P  [HB9500M953P]
J7  DB125-3.81-2P  [SHDR2W80P0X381_1X2_802X740X880P]
J8  DB125-3.81-2P  [SHDR2W80P0X381_1X2_802X740X880P]
J9  DB125-3.81-2P  [SHDR2W80P0X381_1X2_802X740X880P]
J10  RJ-804-1-6  [RJ80416]
J11  FTSH-107-01-L-DV-K  [FP-FTSH-107-01-L-DV-K-MFG]  (parts A,B of 2)
J12  DB125-3.81-2P  [SHDR2W80P0X381_1X2_802X740X880P]
R37  value DNP  [RES_SM1206_YAGEORC_N]  (hidden comment: RES 1206 DNP 1%)
R38  value DNP  [RES_SM1206_YAGEORC_N]  (hidden comment: RES 1206 DNP 1%)
R39  value DNP  [RES_SM1206_YAGEORC_N]  (hidden comment: RES 1206 DNP 1%)  (no BOM)
R40  value 0R  [RES_SM1206_YAGEORC_N]  (hidden comment: RES 1206 0R 1%)
R41  value 0R  [RES_SM1206_YAGEORC_N]  (hidden comment: RES 1206 0R 1%)
R42  value DNP  [RES_SM1206_YAGEORC_N]  (hidden comment: RES 1206 DNP 1%)  (no BOM)

### Blocks framed on the sheet
BMS CAN: J2 R37 R38
TPL connector: J3
Contactor: J4
Aux Relay: J5
HV Connector: J6
Aux 12V/3.3V: J7-J9
CAN RS485 Inverter: J10 R39-R42
Debug: J11

### Ports
AUX_IO (out, harness AUX_IO, see Top[3C], STM32_IO[5B]), AUX_RELAY (out, harness AUX_RELAY, see Top[3D], Peripherals[7C]), CAN_DIF (out, harness CAN_DIF, see Top[3C], Transceivers[8C]), CONTACTOR (out, harness CONTACTOR, see Top[3C], Peripherals[7A]), DEBUG (harness STDC14, see Top[3C], STM32_IO[4A]), RS485 (out, harness RS485_DIF, see Top[3C]), TPL (out, harness TPL, see Top[3C], Transceivers[7A])

### Harnesses
CAN_DIF: CANL, CANH
CONTACTOR: CONT+, CONT-
TPL: TPL_N, TPL_P
STDC14: SWDIO, SWCLK, NRST, SWO, VCP_RX, VCP_TX
RS485_DIF: A, B
AUX_RELAY: RELAY_B, RELAY_A
AUX_IO: IO1, IO2

### Nets
GND: J7.2 J8.2 J11.5 J11.7 J11.11
GND_INV: J9.2 R37.1 R38.1
HV_BAT+: J6.1
HV_BAT-: J6.3
HV_L+: J6.2
p3v3: J7.1 J11.3
p3v3_INV: J9.1
p12v0: J4.1 J8.1 ; port CONTACTOR.CONT+  [also labelled CONTACTOR+]
A: R41.1 R42.1 ; port RS485.A
AUX_IO1: J12.1 ; port AUX_IO.IO1
AUX_IO2: J12.2 ; port AUX_IO.IO2
B: R39.1 R40.1 ; port RS485.B
CAN_CON_PIN3: J2.3 R38.2
CAN_CON_PIN6: J2.6 R37.2
CANH: J2.4 ; port CAN_DIF.CANH  [project net CAN_HI]
CANL: J2.5 ; port CAN_DIF.CANL  [project net CAN_LO]
CONTACTOR-: J4.2 ; port CONTACTOR.CONT-
NRST: J11.12 ; port DEBUG.NRST
RELAY_A: J5.2 ; port AUX_RELAY.RELAY_A
RELAY_B: J5.1 ; port AUX_RELAY.RELAY_B
RS485_A: J10.1 R39.2 R41.2
RS485_B: J10.2 R40.2 R42.2
SWCLK: J11.6 ; port DEBUG.SWCLK
SWDIO: J11.4 ; port DEBUG.SWDIO
SWO: J11.8 ; port DEBUG.SWO
TPL_N: J3.5 ; port TPL.TPL_N
TPL_P: J3.4 ; port TPL.TPL_P
VCP_RX: J11.13 ; port DEBUG.VCP_RX
VCP_TX: J11.14 ; port DEBUG.VCP_TX

Not connected (* = marked no-connect by the designer): J2 1* 2* 7* 8*; J3 1* 2* 3* 6* 7* 8*; J10 3* 4* 5* 6* 7* 8*; J11 1* 2* 9* 10*

### Layout directives
net class INV: A, B, CAN_CON_PIN3, CAN_CON_PIN6, CANH, CANL, GND_INV, p3v3_INV, RS485_A, RS485_B

### Notes on the sheet
- (near R37) Optional GND connection
- (near J3) Unshielded connector to guarantee isolation between modules
- Aux IO
- Team
- Authors
- Revision
- Title
- Project
- Subsystem
- File
- Sheet
- //

### Library data of the parts
J2 J3 J10 = RJ-804-1-6: Connector; Manufacturer_Name: FG; Datasheet Link: https://www.lcsc.com/datasheet/lcsc_datasheet_2306211558_FG-RJ-804-1-6_C7205183.pdf; Height: 11.7mm; Manufacturer_Part_Number: RJ-804-1-6
J4 J5 J7-J9 J12 = DB125-3.81-2P: Connector; Manufacturer_Name: Cixi Dibo Electronics Co.,LTD; Datasheet Link: https://datasheet.lcsc.com/szlcsc/1910111742_DIBO-DB125-3-81-2P_C395878.pdf; Height: 8.8mm; Manufacturer_Part_Number: DB125-3.81-2P
J6 = HB9500M-9.5-3P: Connector; Manufacturer_Name: Ningbo Kangnex; Datasheet Link: https://datasheet.lcsc.com/szlcsc/Ningbo-Kangnex-Elec-HB9500-3_C162697.pdf; Height: 13.2mm; Manufacturer_Part_Number: HB9500M-9.5-3P; JLCPCB Part #: C162697
J11 = CMP-02766-001412-1: CONN HEADER SMD 14POS 1.27MM; Number of Contacts: 14; Gender: Male; Termination: Solder; Lead Free: Lead Free; Depth: 5.84mm; Min Operating Temperature: -55°C; Length: 8.89mm; RoHS Compliant: Yes; Housing Material: Polymer; Housing Color: Black; Max Operating Temperature: 125°C; Number of Rows: 2; Pitch: 1.27mm; Radiation Hardening: No; Orientation: Straight; Packaging: Rail/Tube; Contact Material: Bronze; Contact Plating: Gold
R37-R42 = CMP-009-00208-3: as R6 on sheet STM32_IO; Tolerance: 1%; Case/Package: 1206; Mounting Technology: SMD
  R37-R39 R42: JLCPCB Part #: DNP
  R40 R41: JLCPCB Part #: C17888